# EAGLE schematic M8416P (EAGLE 6.6.0)

## Sheet 1 of 7
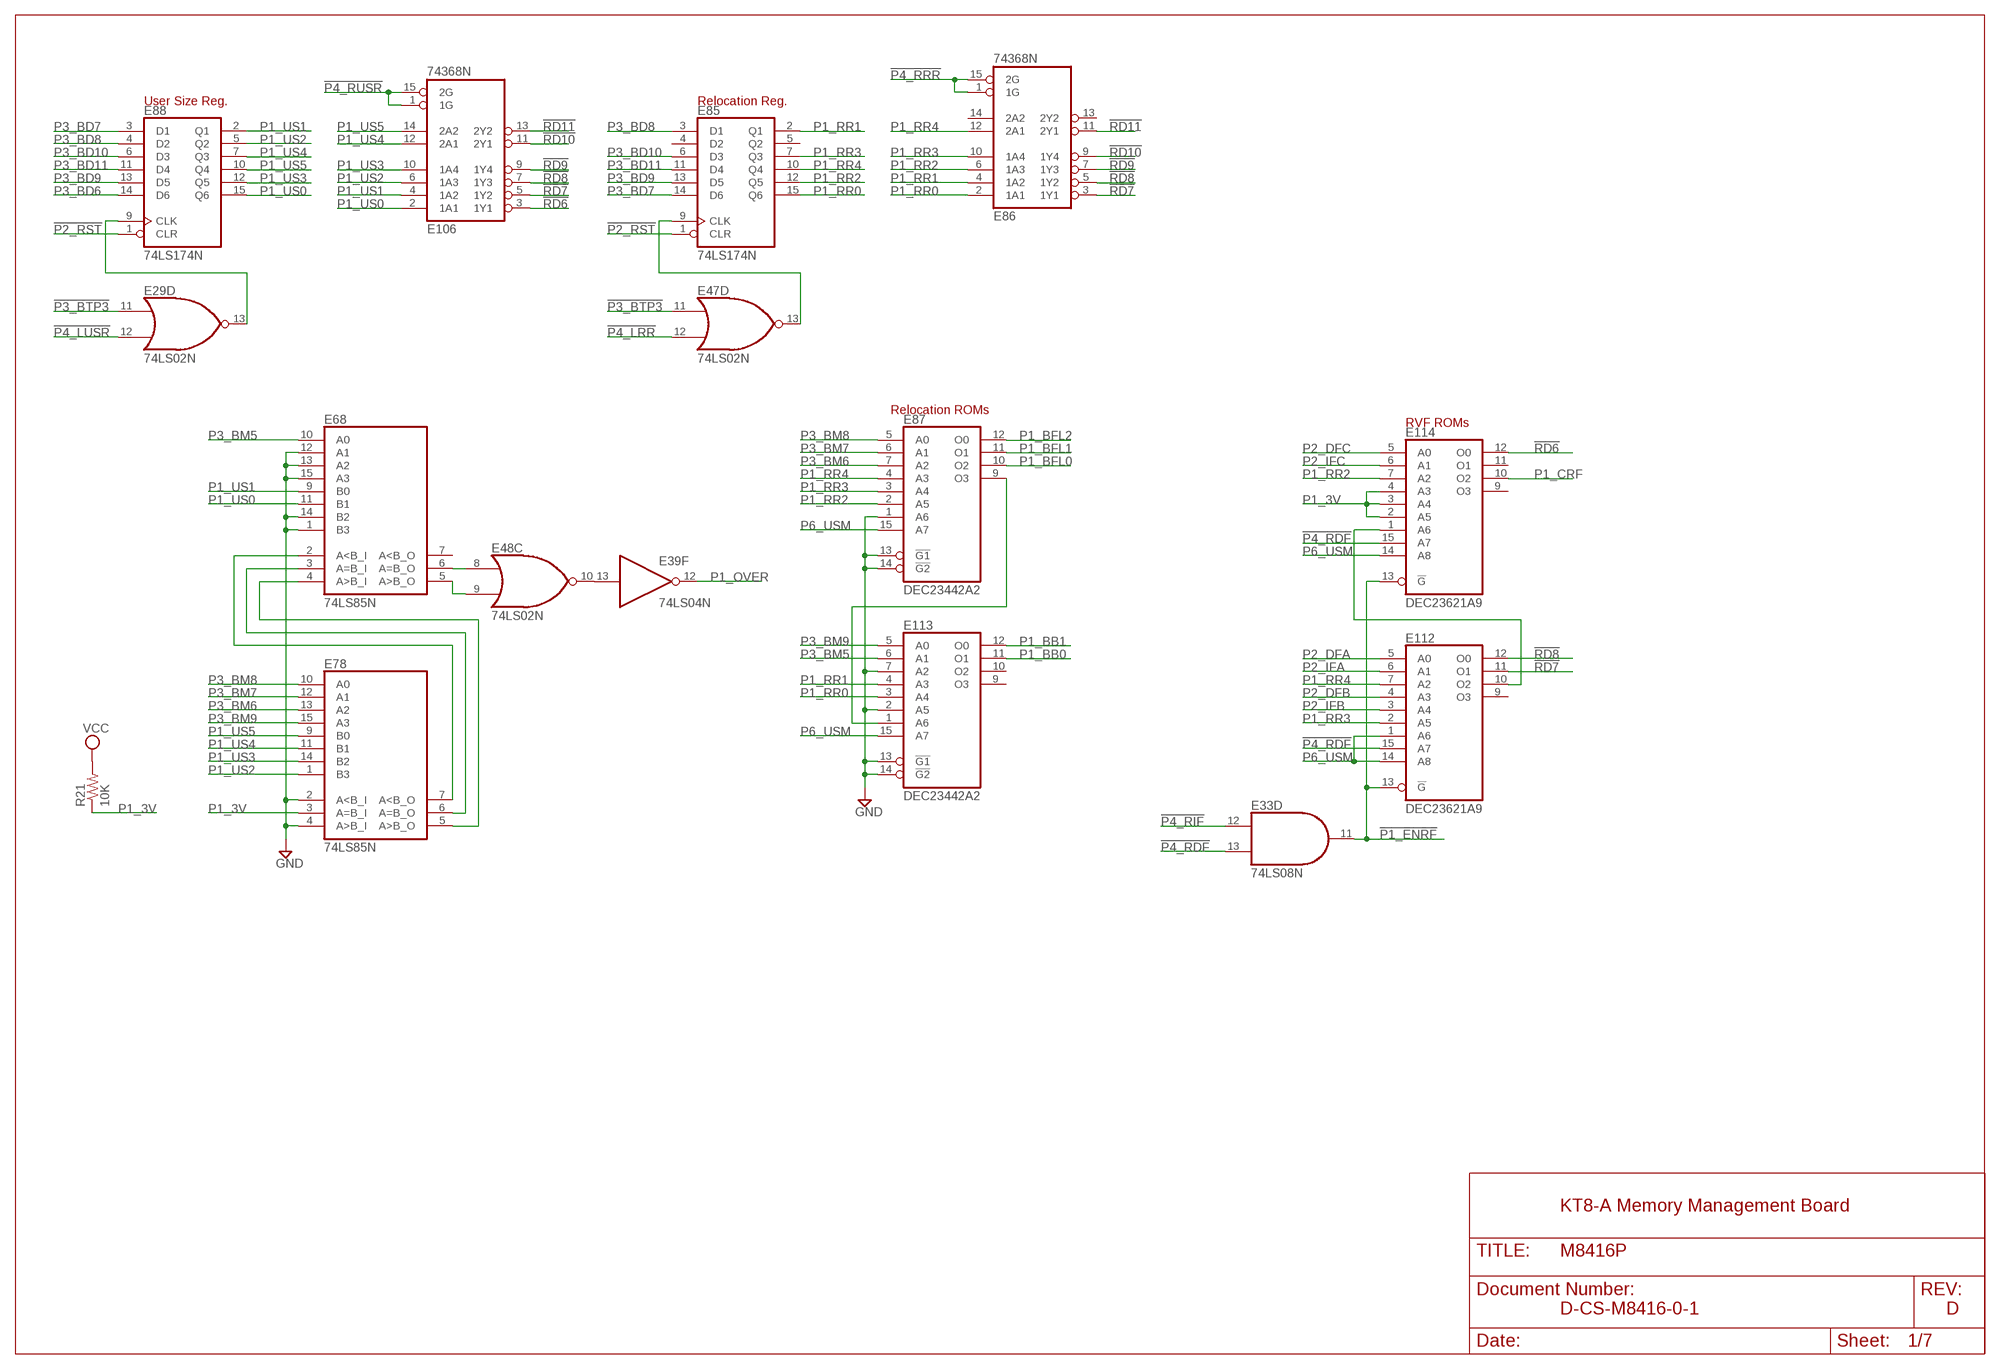
[diagram p0: schematic, sheet 1]

### Parts
E29  74LS02N  [DIL14]
E33  74LS08N  [DIL14]
E39  74LS04N  [DIL14]
E47  74LS02N  [DIL14]
E48  74LS02N  [DIL14]
E68  74LS85N  [DIL16]
E78  74LS85N  [DIL16]
E85  74LS174N  [DIL16]
E86  74368N  [DIL16]
E87  DEC23442A2  74S287  [DIL16]
E88  74LS174N  [DIL16]
E106  74368N  [DIL16]
E112  DEC23621A9  74S571  [DIL16]
E113  DEC23442A2  74S287  [DIL16]
E114  DEC23621A9  74S571  [DIL16]
R21  10K  R-US_0207/10  [0207/10]

### Nets
!P1_ENRF: E33.11(D:O) E112.13(!G) E114.13(!G) ; also sheet 5,6
!P2_RST: E85.1(CLR) E88.1(CLR) ; also sheet 2,6
!P3_BTP3: E29.11(D:I0) E47.11(D:I0) ; also sheet 3,6
!P4_LRR: E47.12(D:I1) ; also sheet 4
!P4_LUSR: E29.12(D:I1) ; also sheet 4
!P4_RDF: E33.13(D:I1) E112.15(A7) E114.15(A7) ; also sheet 4,5
!P4_RIF: E33.12(D:I0) ; also sheet 4
!P4_RRR: E86.1(1G) E86.15(2G) ; also sheet 4
!P4_RUSR: E106.1(1G) E106.15(2G) ; also sheet 4
!RD6: E106.3(1Y1) E114.12(O0) ; also sheet 2,3,5,6
!RD7: E86.3(1Y1) E106.5(1Y2) E112.11(O1) ; also sheet 2,3,5,6
!RD8: E86.5(1Y2) E106.7(1Y3) E112.12(O0) ; also sheet 2,3,5,6
!RD9: E86.7(1Y3) E106.9(1Y4) ; also sheet 2,3,5
!RD10: E86.9(1Y4) E106.11(2Y1) ; also sheet 2,3,5
!RD11: E86.11(2Y1) E106.13(2Y2) ; also sheet 2,3,5
GND: E68.1(B3) E68.12(A1) E68.13(A2) E68.14(B2) E68.15(A3) E78.2(A<B_I) E78.4(A>B_I) E87.1(A6) E87.13(!G1) E87.14(!G2) E113.2(A5) E113.7(A2) E113.13(!G1) E113.14(!G2) ; also sheet 2,3,4,5,6
N$1: E29.13(D:O) E88.9(CLK)
N$6: E112.10(O2) E114.1(A6)
N$8: E48.9(C:I1) E68.5(A>B_O)
N$9: E68.2(A<B_I) E78.7(A<B_O)
N$10: E68.3(A=B_I) E78.6(A=B_O)
N$11: E68.4(A>B_I) E78.5(A>B_O)
N$12: E48.8(C:I0) E68.6(A=B_O)
N$13: E39.13(F:I) E48.10(C:O)
N$15: E47.13(D:O) E85.9(CLK)
N$22: E87.9(O3) E113.1(A6)
P1_3V: E78.3(A=B_I) E114.2(A5) E114.3(A4) E114.4(A3) R21.1
P1_BB0: E113.11(O1) ; also sheet 5
P1_BB1: E113.12(O0) ; also sheet 5
P1_BFL0: E87.10(O2) ; also sheet 2
P1_BFL1: E87.11(O1) ; also sheet 2
P1_BFL2: E87.12(O0) ; also sheet 2
P1_CRF: E114.10(O2) ; also sheet 5
P1_OVER: E39.12(F:O) ; also sheet 4
P1_RR0: E85.15(Q6) E86.2(1A1) E113.3(A4) ; also sheet 5
P1_RR1: E85.2(Q1) E86.4(1A2) E113.4(A3) ; also sheet 5
P1_RR2: E85.12(Q5) E86.6(1A3) E87.2(A5) E114.7(A2)
P1_RR3: E85.7(Q3) E86.10(1A4) E87.3(A4) E112.2(A5)
P1_RR4: E85.10(Q4) E86.12(2A1) E87.4(A3) E112.7(A2)
P1_US0: E68.11(B1) E88.15(Q6) E106.2(1A1)
P1_US1: E68.9(B0) E88.2(Q1) E106.4(1A2)
P1_US2: E78.1(B3) E88.5(Q2) E106.6(1A3)
P1_US3: E78.14(B2) E88.12(Q5) E106.10(1A4)
P1_US4: E78.11(B1) E88.7(Q3) E106.12(2A1)
P1_US5: E78.9(B0) E88.10(Q4) E106.14(2A2)
P2_DFA: E112.5(A0) ; also sheet 2
P2_DFB: E112.4(A3) ; also sheet 2
P2_DFC: E114.5(A0) ; also sheet 2
P2_IFA: E112.6(A1) ; also sheet 2
P2_IFB: E112.3(A4) ; also sheet 2
P2_IFC: E114.6(A1) ; also sheet 2
P3_BD6: E88.14(D6) ; also sheet 2,3,5,6
P3_BD7: E85.14(D6) E88.3(D1) ; also sheet 2,3,5
P3_BD8: E85.3(D1) E88.4(D2) ; also sheet 2,3,5
P3_BD9: E85.13(D5) E88.13(D5) ; also sheet 2,3,5
P3_BD10: E85.6(D3) E88.6(D3) ; also sheet 2,3,5
P3_BD11: E85.11(D4) E88.11(D4) ; also sheet 2,3,5
P3_BM5: E68.10(A0) E113.6(A1) ; also sheet 3,4
P3_BM6: E78.13(A2) E87.7(A2) ; also sheet 3,4
P3_BM7: E78.12(A1) E87.6(A1) ; also sheet 3,4
P3_BM8: E78.10(A0) E87.5(A0) ; also sheet 3,4
P3_BM9: E78.15(A3) E113.5(A0) ; also sheet 3,4
P6_USM: E87.15(A7) E112.1(A6) E112.14(A8) E113.15(A7) E114.14(A8) ; also sheet 3,4,5,6
VCC: R21.2 ; also sheet 2,3,4,5,6
Unconnected: E68.7(A<B_O) E85.4(D2) E85.5(Q2) E86.13(2Y2) E86.14(2A2) E112.9(O3) E113.9(O3) E113.10(O2) E114.9(O3) E114.11(O1)

### Notes on the sheet
- User Size Reg. | Relocation Reg.
- Relocation ROMs
- RVF ROMs
- KT8-A Memory Management Board
- D-CS-M8416-0-1 | D

## Sheet 2 of 7
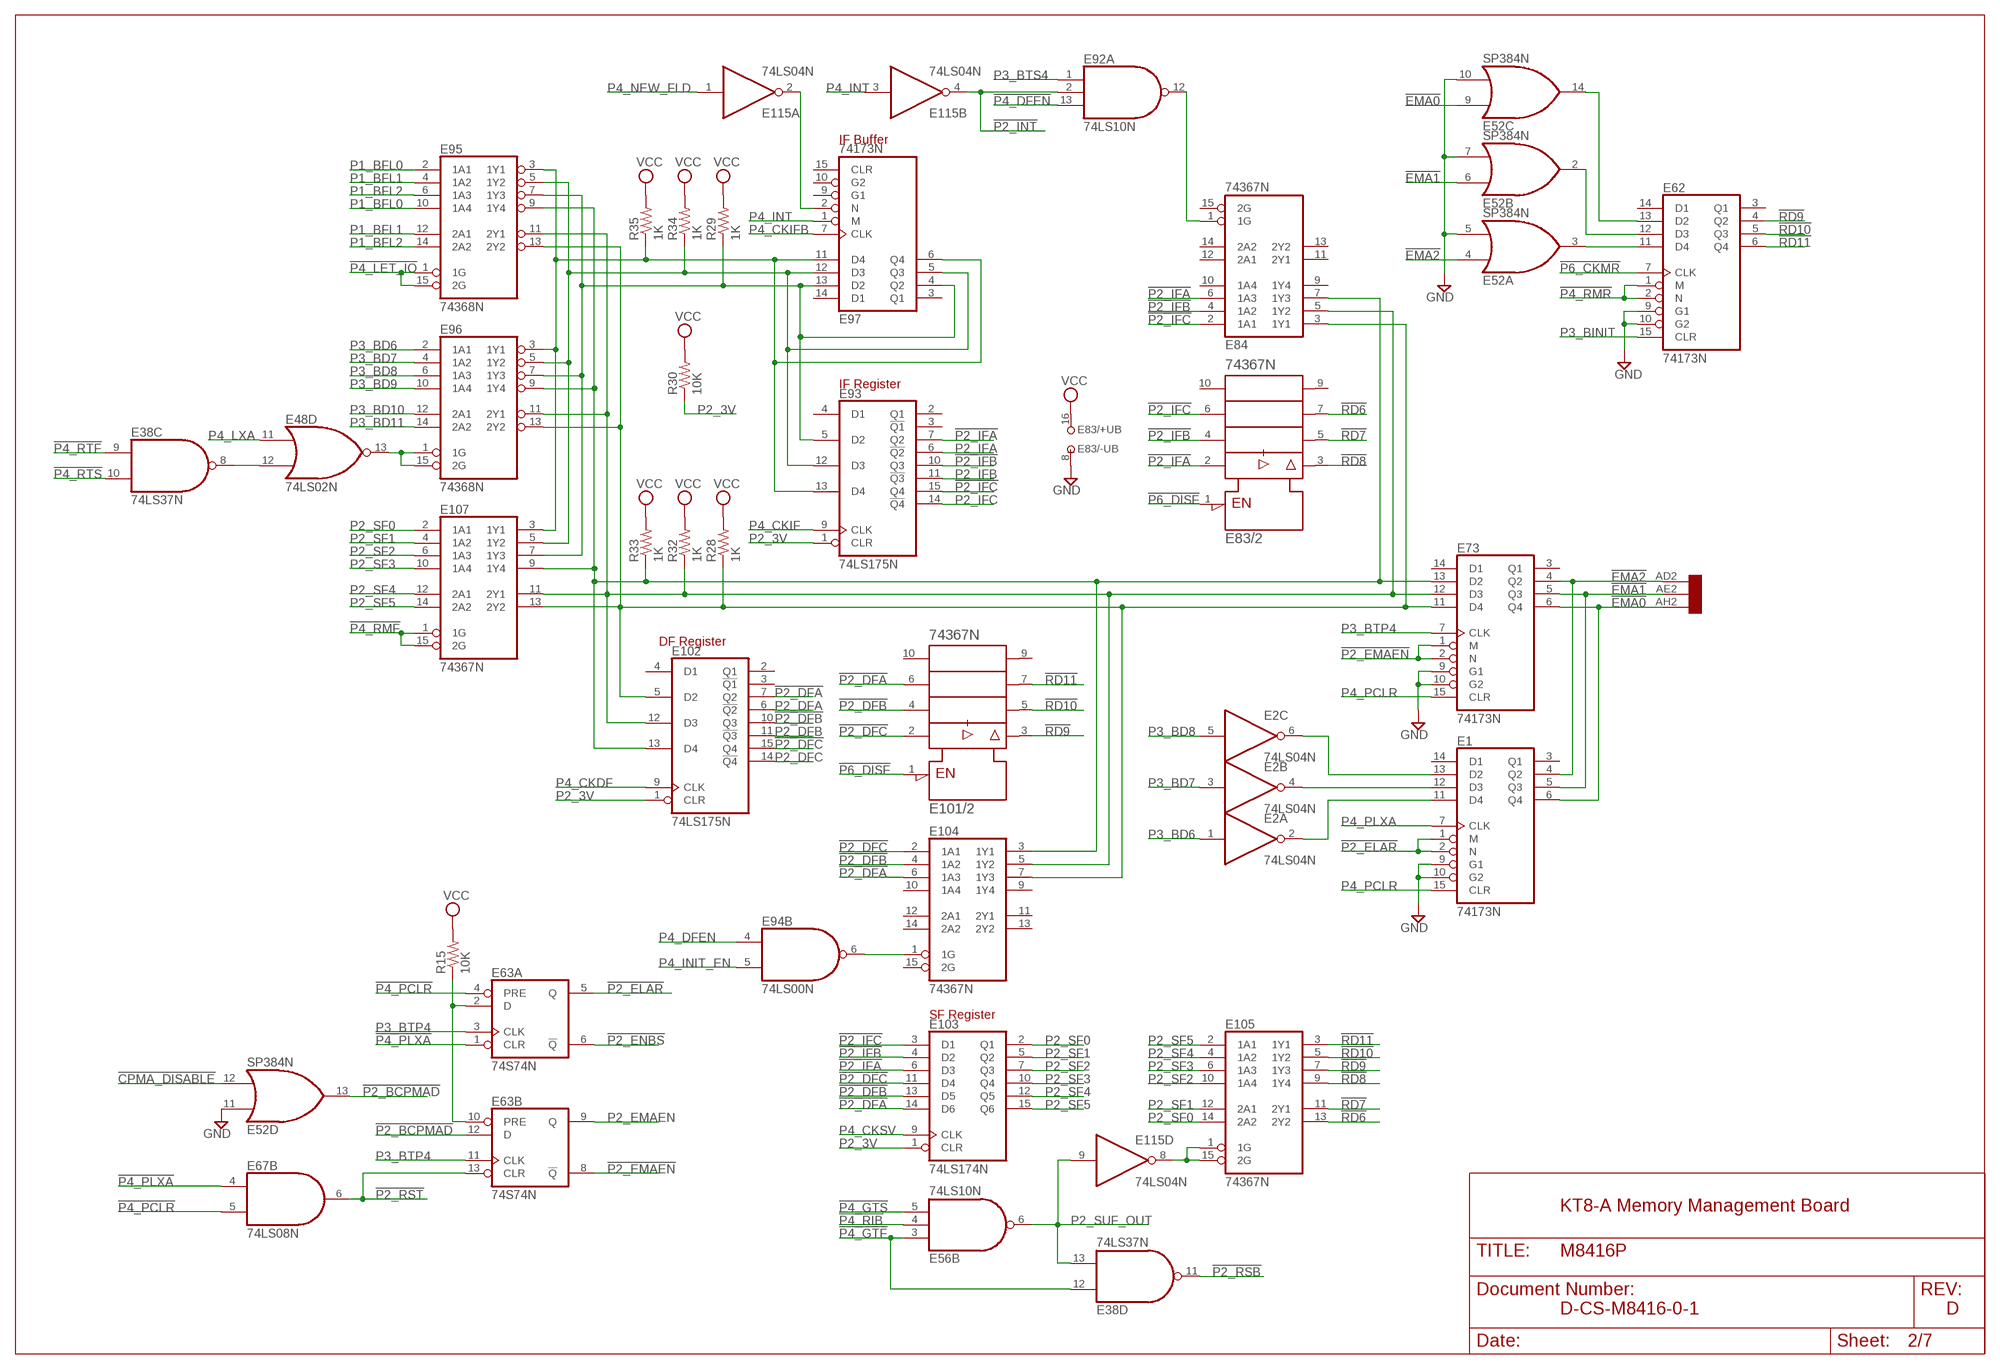
[diagram p1: schematic, sheet 2]

### Parts
E1  74173N  74LS173N  [DIL16]
E2  74LS04N  [DIL14]
E38  74LS37N  [DIL14]
E52  SP384N  [DIL14]
E56  74LS10N  [DIL14]
E62  74173N  74LS173N  [DIL16]
E63  74S74N  [DIL14]
E67  74LS08N  [DIL14]
E73  74173N  74LS173N  [DIL16]
E83  74367N  [DIL16]
E84  74367N  [DIL16]
E92  74LS10N  [DIL14]
E93  74LS175N  [DIL16]
E94  74LS00N  [DIL14]
E95  74368N  [DIL16]
E96  74368N  [DIL16]
E97  74173N  74LS173N  [DIL16]
E101  74367N  [DIL16]
E102  74LS175N  [DIL16]
E103  74LS174N  [DIL16]
E104  74367N  [DIL16]
E105  74367N  [DIL16]
E107  74367N  [DIL16]
E115  74LS04N  [DIL14]
R15  10K  R-US_0207/10  [0207/10]
R28  1K  R-US_0207/10  [0207/10]
R29  1K  R-US_0207/10  [0207/10]
R30  10K  R-US_0207/10  [0207/10]
R32  1K  R-US_0207/10  [0207/10]
R33  1K  R-US_0207/10  [0207/10]
R34  1K  R-US_0207/10  [0207/10]
R35  1K  R-US_0207/10  [0207/10]
U$1  HEX  [EDGE-CON12]

### Nets
!CPMA_DISABLE: E52.12(D:I1) ; also sheet 3
!EMA0: E1.6(Q4) E52.9(C:I0) E73.6(Q4) U$1.AH2
!EMA1: E1.5(Q3) E52.6(B:I0) E73.5(Q3) U$1.AE2
!EMA2: E1.4(Q2) E52.4(A:I0) E73.4(Q2) U$1.AD2
!P2_BCPMAD: E52.13(D:O) E63.12(B:D) ; also sheet 5
!P2_DFA: E101.6(/2:A3) E102.7(Q2) E103.14(D6) E104.6(1A3)
!P2_DFB: E101.4(/2:A2) E102.10(Q3) E103.13(D5) E104.4(1A2)
!P2_DFC: E101.2(/2:A1) E102.15(Q4) E103.11(D4) E104.2(1A1)
!P2_ELAR: E1.1(M) E1.2(N) E63.5(A:Q) ; also sheet 6
!P2_EMAEN: E63.8(B:!Q) E73.1(M) E73.2(N)
!P2_ENBS: E63.6(A:!Q) ; also sheet 6
!P2_IFA: E83.2(/2:A1) E84.6(1A3) E93.7(Q2) E103.6(D3)
!P2_IFB: E83.4(/2:A2) E84.4(1A2) E93.10(Q3) E103.4(D2)
!P2_IFC: E83.6(/2:A3) E84.2(1A1) E93.15(Q4) E103.3(D1)
!P2_INT: E92.2(A:I1) E115.4(B:O)
!P2_RSB: E38.11(D:O) ; also sheet 5
!P2_RST: E63.13(B:CLR) E67.6(B:O) ; also sheet 1,6
!P4_DFEN: E92.13(A:I2) ; also sheet 4
!P4_GTF: E38.12(D:I0) E56.3(B:I0) ; also sheet 4,6
!P4_GTS: E56.5(B:I2) ; also sheet 4,6
!P4_LET_IO: E95.1(1G) E95.15(2G) ; also sheet 4
!P4_PCLR: E63.4(A:PRE) E67.5(B:I1) ; also sheet 4,6
!P4_PLXA: E63.1(A:CLR) E67.4(B:I0) ; also sheet 4
!P4_RIB: E56.4(B:I1) ; also sheet 4
!P4_RMF: E107.1(1G) E107.15(2G) ; also sheet 4,5,6
!P4_RMR: E62.1(M) E62.2(N) ; also sheet 4,6
!P4_RTF: E38.9(C:I0) ; also sheet 4
!P4_RTS: E38.10(C:I1) ; also sheet 4,5
!P6_CKMR: E62.7(CLK) ; also sheet 6
!P6_DISF: E83.1(/2:!G) E101.1(/2:!G) ; also sheet 6
!RD6: E83.7(/2:Y3) E105.13(2Y2) ; also sheet 1,3,5,6
!RD7: E83.5(/2:Y2) E105.11(2Y1) ; also sheet 1,3,5,6
!RD8: E83.3(/2:Y1) E105.9(1Y4) ; also sheet 1,3,5,6
!RD9: E62.4(Q2) E101.3(/2:Y1) E105.7(1Y3) ; also sheet 1,3,5
!RD10: E62.5(Q3) E101.5(/2:Y2) E105.5(1Y2) ; also sheet 1,3,5
!RD11: E62.6(Q4) E101.7(/2:Y3) E105.3(1Y1) ; also sheet 1,3,5
GND: E1.9(G1) E1.10(G2) E52.5(A:I1) E52.7(B:I1) E52.10(C:I1) E52.11(D:I0) E62.9(G1) E62.10(G2) E73.9(G1) E73.10(G2) E83.8(/-UB:-UB) ; also sheet 1,3,4,5,6
N$2: E48.13(D:O) E96.1(1G) E96.15(2G)
N$3: E38.8(C:O) E48.12(D:I1)
N$18: E93.13(D4) E95.3(1Y1) E96.3(1Y1) E97.6(Q4) E97.11(D4) E107.3(1Y1) R35.1
N$19: E93.12(D3) E95.5(1Y2) E96.5(1Y2) E97.5(Q3) E97.12(D3) E107.5(1Y2) R34.1
N$20: E93.5(D2) E95.7(1Y3) E96.7(1Y3) E97.4(Q2) E97.13(D2) E107.7(1Y3) R29.1
N$38: E73.13(D2) E84.7(1Y3) E95.9(1Y4) E96.9(1Y4) E102.13(D4) E104.3(1Y1) E107.9(1Y4) R33.1
N$39: E73.12(D3) E84.5(1Y2) E95.11(2Y1) E96.11(2Y1) E102.12(D3) E104.5(1Y2) E107.11(2Y1) R32.1
N$40: E73.11(D4) E84.3(1Y1) E95.13(2Y2) E96.13(2Y2) E102.5(D2) E104.7(1Y3) E107.13(2Y2) R28.1
N$41: E97.2(N) E115.2(A:O)
N$42: E84.1(1G) E92.12(A:O)
N$43: E1.11(D4) E2.2(A:O)
N$44: E1.12(D3) E2.4(B:O)
N$45: E1.13(D2) E2.6(C:O)
N$46: E52.3(A:O) E62.11(D4)
N$47: E52.2(B:O) E62.12(D3)
N$48: E52.14(C:O) E62.13(D2)
N$49: E94.6(B:O) E104.1(1G)
N$50: E63.2(A:D) E63.10(B:PRE) R15.1
N$56: E105.1(1G) E105.15(2G) E115.8(D:O)
P1_BFL0: E95.2(1A1) E95.10(1A4) ; also sheet 1
P1_BFL1: E95.4(1A2) E95.12(2A1) ; also sheet 1
P1_BFL2: E95.6(1A3) E95.14(2A2) ; also sheet 1
P2_3V: E93.1(CLR) E102.1(CLR) E103.1(CLR) R30.1
P2_DFA: E102.6(!Q2) ; also sheet 1
P2_DFB: E102.11(!Q3) ; also sheet 1
P2_DFC: E102.14(!Q4) ; also sheet 1
P2_EMAEN: E63.9(B:Q) ; also sheet 6
P2_IFA: E93.6(!Q2) ; also sheet 1
P2_IFB: E93.11(!Q3) ; also sheet 1
P2_IFC: E93.14(!Q4) ; also sheet 1
P2_SF0: E103.2(Q1) E105.14(2A2) E107.2(1A1)
P2_SF1: E103.5(Q2) E105.12(2A1) E107.4(1A2)
P2_SF2: E103.7(Q3) E105.10(1A4) E107.6(1A3)
P2_SF3: E103.10(Q4) E105.6(1A3) E107.10(1A4)
P2_SF4: E103.12(Q5) E105.4(1A2) E107.12(2A1)
P2_SF5: E103.15(Q6) E105.2(1A1) E107.14(2A2)
P2_SUF_OUT: E38.13(D:I1) E56.6(B:O) E115.9(D:I) ; also sheet 6
P3_BD6: E2.1(A:I) E96.2(1A1) ; also sheet 1,3,5,6
P3_BD7: E2.3(B:I) E96.4(1A2) ; also sheet 1,3,5
P3_BD8: E2.5(C:I) E96.6(1A3) ; also sheet 1,3,5
P3_BD9: E96.10(1A4) ; also sheet 1,3,5
P3_BD10: E96.12(2A1) ; also sheet 1,3,5
P3_BD11: E96.14(2A2) ; also sheet 1,3,5
P3_BINIT: E62.15(CLR) ; also sheet 3,5,6
P3_BTP4: E63.3(A:CLK) E63.11(B:CLK) E73.7(CLK) ; also sheet 3,4,5,6
P3_BTS4: E92.1(A:I0) ; also sheet 3,5
P4_CKDF: E102.9(CLK) ; also sheet 4
P4_CKIF: E93.9(CLK) ; also sheet 4,5
P4_CKIFB: E97.7(CLK) ; also sheet 4
P4_CKSV: E103.9(CLK) ; also sheet 4,5,6
P4_DFEN: E94.4(B:I0) ; also sheet 4,5
P4_INIT_EN: E94.5(B:I1) ; also sheet 4
P4_INT: E97.1(M) E115.3(B:I) ; also sheet 4
P4_LXA: E48.11(D:I0) ; also sheet 3,4,5
P4_NEW_FLD: E115.1(A:I) ; also sheet 4,5,6
P4_PCLR: E1.15(CLR) E73.15(CLR) ; also sheet 4,6
P4_PLXA: E1.7(CLK) ; also sheet 4,6
VCC: E83.16(/+UB:+UB) R15.2 R28.2 R29.2 R30.2 R32.2 R33.2 R34.2 R35.2 ; also sheet 1,3,4,5,6
Unconnected: E1.3(Q1) E1.14(D1) E62.3(Q1) E62.14(D1) E73.3(Q1) E73.14(D1) E83.9(/2:Y4) E83.10(/2:A4) E84.9(1Y4) E84.10(1A4) E84.11(2Y1) E84.12(2A1) E84.13(2Y2) E84.14(2A2) E84.15(2G) E93.2(Q1) E93.3(!Q1) E93.4(D1) E97.3(Q1) E97.9(G1) E97.10(G2) E97.14(D1) E97.15(CLR) E101.9(/2:Y4) E101.10(/2:A4) E102.2(Q1) E102.3(!Q1) E102.4(D1) E104.9(1Y4) E104.10(1A4) E104.11(2Y1) E104.12(2A1) E104.13(2Y2) E104.14(2A2) E104.15(2G) U$1.AA1 U$1.AB1 U$1.AB2 U$1.AD1 U$1.AE1 U$1.AH1 U$1.AJ1 U$1.AJ2 U$1.AK2 U$1.AL2 U$1.AM2 U$1.AP2 U$1.AR2 U$1.AS2 U$1.AU2 U$1.BA1 U$1.BB1 U$1.BB2 U$1.BD1 U$1.BD2 U$1.BE1 U$1.BH1 U$1.BJ1 U$1.BJ2 U$1.BK2 U$1.BL2 U$1.BR2 U$1.BS2 U$1.CA1 U$1.CB1 U$1.CB2 U$1.CJ1 U$1.CK1 U$1.CL2 U$1.CM1 U$1.CR2 U$1.CS2 U$1.DA1 U$1.DB1 U$1.DB2 U$1.DD1 U$1.DE1 U$1.DH1 U$1.DH2 U$1.DJ1 U$1.DL2 U$1.DS2 U$1.DV2 U$1.EA1 U$1.EA2 U$1.EB1 U$1.EC1 U$1.EC2 U$1.ED1 U$1.EE1 U$1.EE2 U$1.EF1 U$1.EF2 U$1.EH1 U$1.EH2 U$1.EJ1 U$1.EJ2 U$1.EK1 U$1.EK2 U$1.EL1 U$1.EM1 U$1.EM2 U$1.EN1 U$1.EN2 U$1.EP1 U$1.ER1 U$1.ER2 U$1.ES1 U$1.ES2 U$1.ET1 U$1.ET2 U$1.EU1 U$1.EU2 U$1.EV1 U$1.EV2 U$1.FA1 U$1.FA2 U$1.FB1 U$1.FB2 U$1.FC1 U$1.FC2 U$1.FD1 U$1.FD2 U$1.FE1 U$1.FE2 U$1.FF1 U$1.FF2 U$1.FH1 U$1.FH2 U$1.FJ1 U$1.FJ2 U$1.FK1 U$1.FK2 U$1.FL1 U$1.FL2 U$1.FM1 U$1.FM2 U$1.FN1 U$1.FN2 U$1.FP1 U$1.FP2 U$1.FR1 U$1.FR2 U$1.FS1 U$1.FS2 U$1.FT1 U$1.FT2 U$1.FU1 U$1.FU2 U$1.FV1 U$1.FV2

### Notes on the sheet
- IF Buffer
- IF Register
- DF Register
- SF Register
- KT8-A Memory Management Board
- D-CS-M8416-0-1 | D

## Sheet 3 of 7
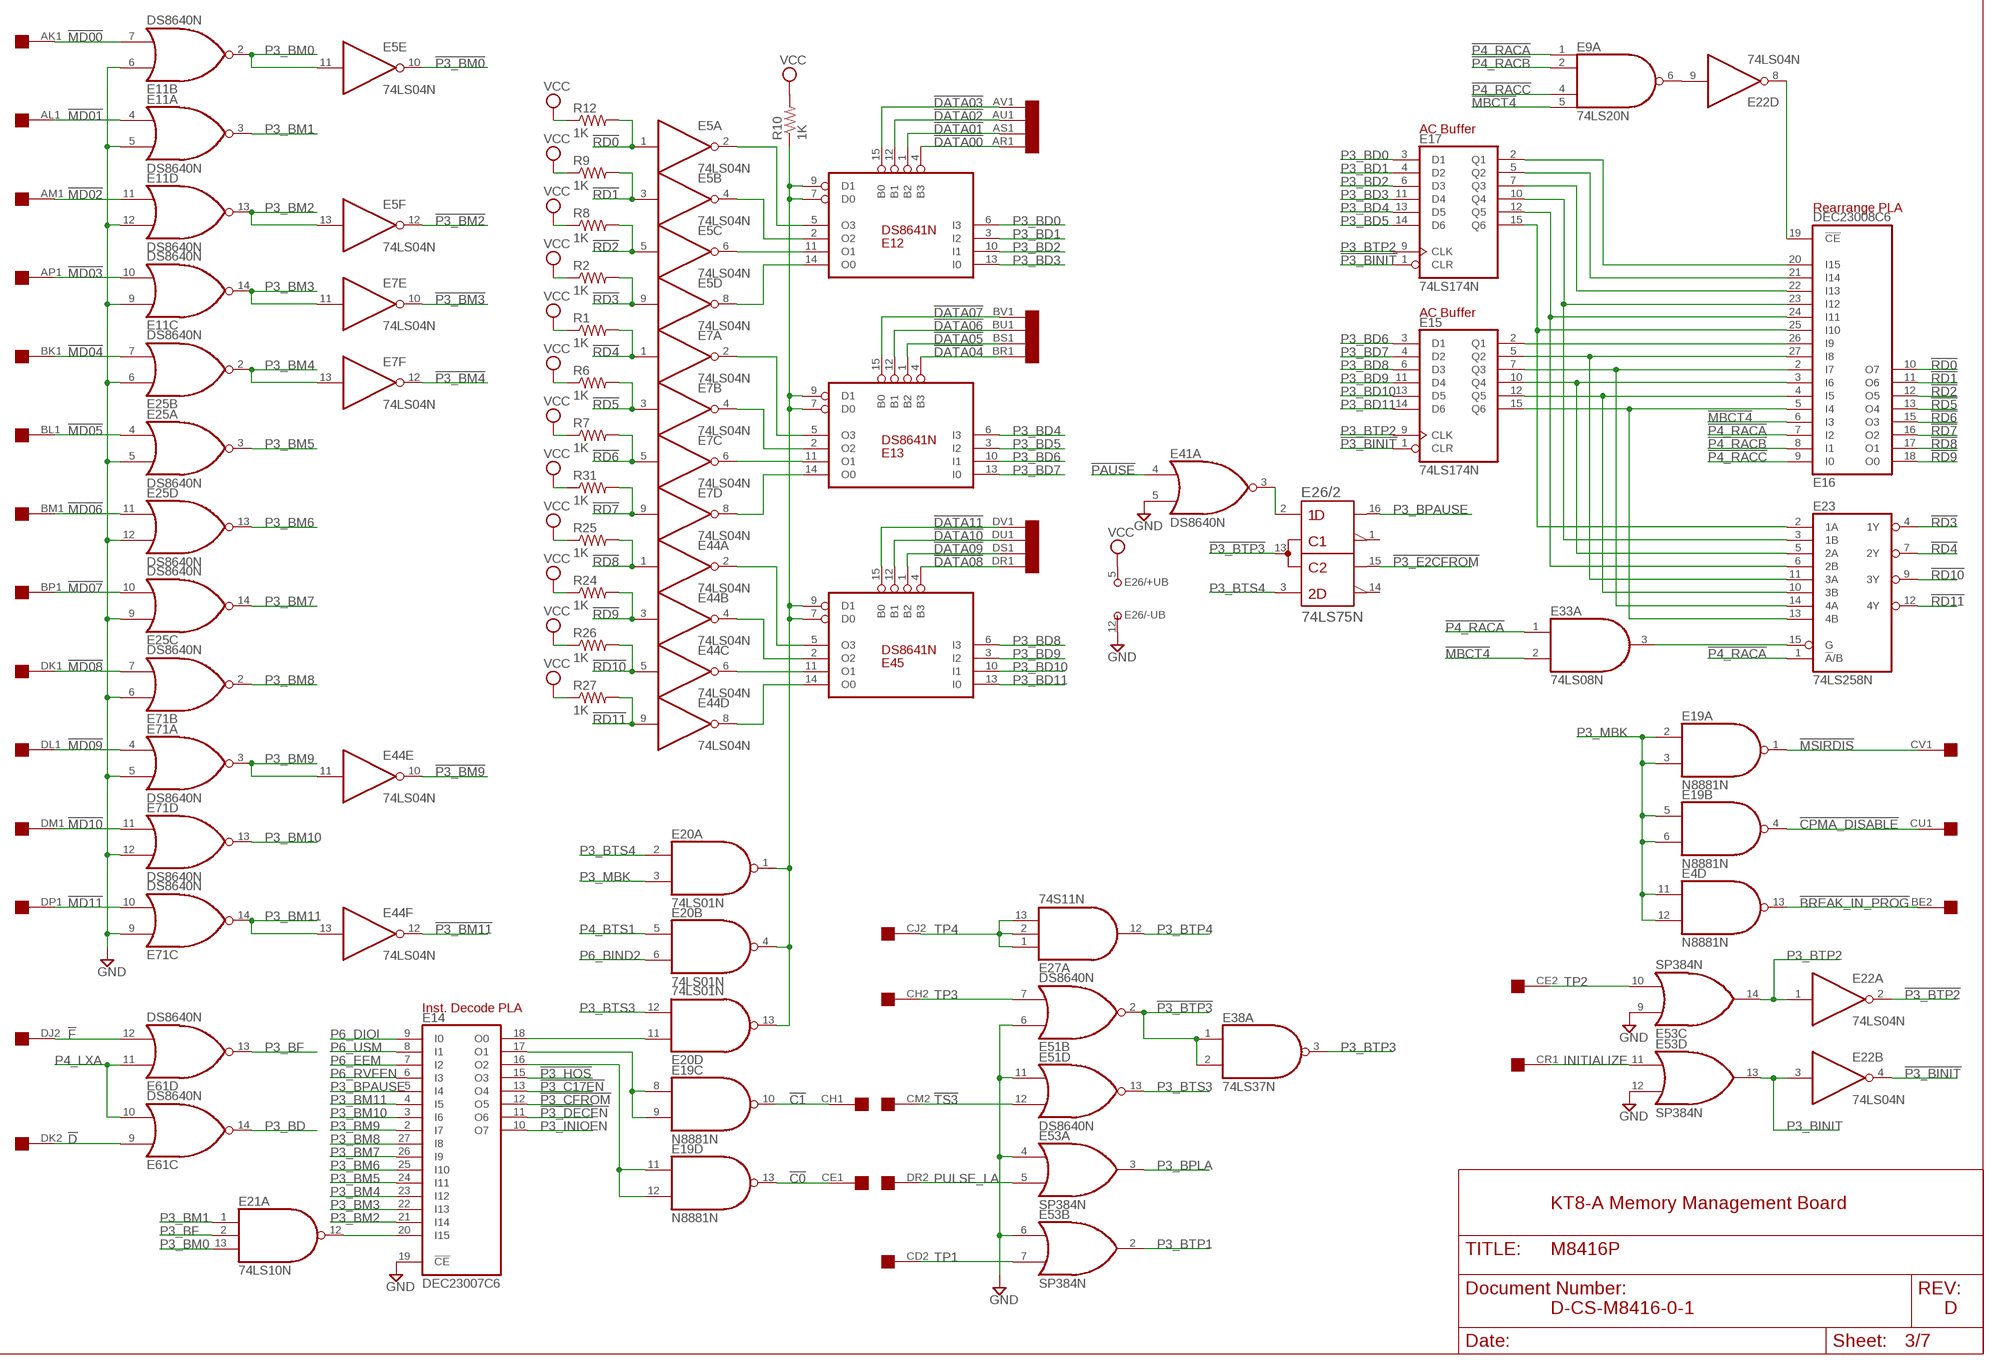
[diagram p2: schematic, sheet 3, part 1 of 2]
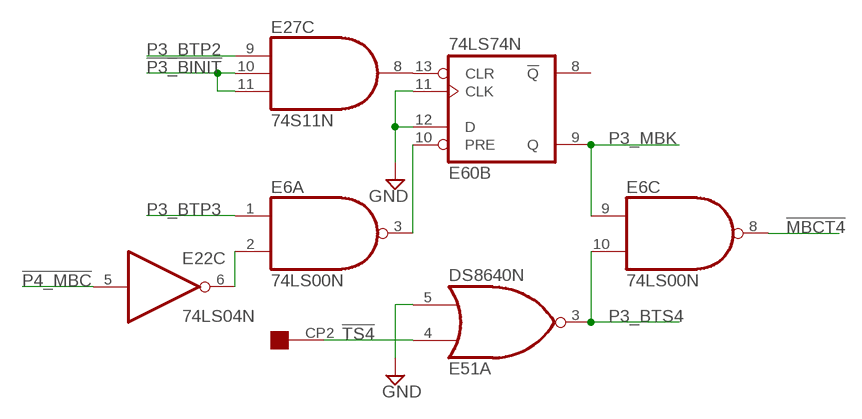
[diagram p3: schematic, sheet 3, part 2 of 2]

### Parts
E4  N8881N  [DIL14]
E5  74LS04N  [DIL14]
E6  74LS00N  [DIL14]
E7  74LS04N  [DIL14]
E9  74LS20N  [DIL14]
E11  DS8640N  [DIL14]
E12  DS8641N  [DIL16]
E13  DS8641N  [DIL16]
E14  DEC23007C6  82S100  [DIL28]
E15  74LS174N  [DIL16]
E16  DEC23008C6  82S100  [DIL28]
E17  74LS174N  [DIL16]
E19  N8881N  [DIL14]
E20  74LS01N  [DIL14]
E21  74LS10N  [DIL14]
E22  74LS04N  [DIL14]
E23  74LS258N  [DIL16]
E25  DS8640N  [DIL14]
E26  74LS75N  7475N  [DIL16]
E27  74S11N  [DIL14]
E41  DS8640N  [DIL14]
E44  74LS04N  [DIL14]
E45  DS8641N  [DIL16]
E51  DS8640N  [DIL14]
E53  SP384N  [DIL14]
E60  74LS74N  [DIL14]
E61  DS8640N  [DIL14]
E71  DS8640N  [DIL14]
R1  1K  R-US_0207/10  [0207/10]
R2  1K  R-US_0207/10  [0207/10]
R6  1K  R-US_0207/10  [0207/10]
R7  1K  R-US_0207/10  [0207/10]
R8  1K  R-US_0207/10  [0207/10]
R9  1K  R-US_0207/10  [0207/10]
R10  1K  R-US_0207/10  [0207/10]
R12  1K  R-US_0207/10  [0207/10]
R24  1K  R-US_0207/10  [0207/10]
R25  1K  R-US_0207/10  [0207/10]
R26  1K  R-US_0207/10  [0207/10]
R27  1K  R-US_0207/10  [0207/10]
R31  1K  R-US_0207/10  [0207/10]

### Nets
!BREAK_IN_PROG: E4.13(D:O) U$1.BE2
!C0: E19.13(D:O) U$1.CE1
!C1: E19.10(C:O) U$1.CH1
!CPMA_DISABLE: E19.4(B:O) U$1.CU1 ; also sheet 2
!D: E61.9(C:I0) U$1.DK2
!DATA00: E12.4(B3) U$1.AR1
!DATA01: E12.1(B2) U$1.AS1
!DATA02: E12.12(B1) U$1.AU1
!DATA03: E12.15(B0) U$1.AV1
!DATA04: E13.4(B3) U$1.BR1
!DATA05: E13.1(B2) U$1.BS1
!DATA06: E13.12(B1) U$1.BU1
!DATA07: E13.15(B0) U$1.BV1
!DATA08: E45.4(B3) U$1.DR1
!DATA09: E45.1(B2) U$1.DS1
!DATA10: E45.12(B1) U$1.DU1
!DATA11: E45.15(B0) U$1.DV1
!F: E61.12(D:I1) U$1.DJ2
!MBCT4: E6.8(C:O) E9.5(A:I3) E16.6(I3) E33.2(A:I1)
!MD00: E11.7(B:I1) U$1.AK1
!MD01: E11.4(A:I0) U$1.AL1
!MD02: E11.11(D:I0) U$1.AM1
!MD03: E11.10(C:I1) U$1.AP1
!MD04: E25.7(B:I1) U$1.BK1
!MD05: E25.4(A:I0) U$1.BL1
!MD06: E25.11(D:I0) U$1.BM1
!MD07: E25.10(C:I1) U$1.BP1
!MD08: E71.7(B:I1) U$1.DK1
!MD09: E71.4(A:I0) U$1.DL1
!MD10: E71.11(D:I0) U$1.DM1
!MD11: E71.10(C:I1) U$1.DP1
!MSIRDIS: E19.1(A:O) U$1.CV1
!P3_BINIT: E15.1(CLR) E17.1(CLR) E22.4(B:O) E27.10(C:I1) E27.11(C:I2) ; also sheet 4
!P3_BM0: E5.10(E:O) ; also sheet 4
!P3_BM2: E5.12(F:O) ; also sheet 4
!P3_BM3: E7.10(E:O) ; also sheet 4
!P3_BM4: E7.12(F:O) ; also sheet 4
!P3_BM9: E44.10(E:O) ; also sheet 4
!P3_BM11: E44.12(F:O) ; also sheet 4
!P3_BTP2: E22.2(A:O) ; also sheet 6
!P3_BTP3: E26.13(/2:1C,2C) E38.1(A:I0) E38.2(A:I1) E51.2(B:O) ; also sheet 1,6
!P3_C17EN: E14.13(O4) ; also sheet 4
!P3_CFROM: E14.12(O5) ; also sheet 4
!P3_DECEN: E14.11(O6) ; also sheet 4
!P3_E2CFROM: E26.15(/2:2Q) ; also sheet 4
!P3_HOS: E14.15(O3) ; also sheet 4
!P4_MBC: E22.5(C:I) ; also sheet 4
!P4_RACA: E9.1(A:I0) E16.7(I2) E23.1(!A!/B) E33.1(A:I0) ; also sheet 4
!P4_RACB: E9.2(A:I1) E16.8(I1) ; also sheet 4
!P4_RACC: E9.4(A:I2) E16.9(I0) ; also sheet 4
!PAUSE: E41.4(A:I0) ; also sheet 4
!RD0: E5.1(A:I) E16.10(O7) R12.2 ; also sheet 6
!RD1: E5.3(B:I) E16.11(O6) R9.2 ; also sheet 5,6
!RD2: E5.5(C:I) E16.12(O5) R8.2 ; also sheet 5,6
!RD3: E5.9(D:I) E23.4(1Y) R2.2 ; also sheet 4,5,6
!RD4: E7.1(A:I) E23.7(2Y) R1.2 ; also sheet 5,6
!RD5: E7.3(B:I) E16.13(O4) R6.2 ; also sheet 5,6
!RD6: E7.5(C:I) E16.15(O3) R7.2 ; also sheet 1,2,5,6
!RD7: E7.9(D:I) E16.16(O2) R31.2 ; also sheet 1,2,5,6
!RD8: E16.17(O1) E44.1(A:I) R25.2 ; also sheet 1,2,5,6
!RD9: E16.18(O0) E44.3(B:I) R24.2 ; also sheet 1,2,5
!RD10: E23.9(3Y) E44.5(C:I) R26.2 ; also sheet 1,2,5
!RD11: E23.12(4Y) E44.9(D:I) R27.2 ; also sheet 1,2,5
!TS3: E51.12(D:I1) U$1.CM2
!TS4: E51.4(A:I0) U$1.CP2
GND: E11.5(A:I1) E11.6(B:I0) E11.9(C:I0) E11.12(D:I1) E14.19(!CE) E25.5(A:I1) E25.6(B:I0) E25.9(C:I0) E25.12(D:I1) E26.12(/-UB:-UB) E41.5(A:I1) E51.5(A:I1) E51.6(B:I0) E51.11(D:I0) E53.4(A:I0) E53.6(B:I0) E53.9(C:I0) E53.12(D:I1) E60.11(B:CLK) E60.12(B:D) E71.5(A:I1) E71.6(B:I0) E71.9(C:I0) E71.12(D:I1) ; also sheet 1,2,4,5,6
INITIALIZE: E53.11(D:I0) U$1.CR1
N$5: E27.8(C:O) E60.13(B:CLR)
N$51: E16.20(I15) E17.2(Q1)
N$52: E16.21(I14) E17.5(Q2)
N$53: E16.22(I13) E17.7(Q3)
N$54: E16.23(I12) E17.10(Q4) E23.3(1B)
N$55: E16.24(I11) E17.12(Q5) E23.6(2B)
N$57: E16.25(I10) E17.15(Q6) E23.2(1A)
N$58: E15.2(Q1) E16.26(I9)
N$59: E15.5(Q2) E16.27(I8) E23.11(3A)
N$60: E15.7(Q3) E16.2(I7) E23.14(4A)
N$61: E15.10(Q4) E16.3(I6) E23.5(2A)
N$62: E15.12(Q5) E16.4(I5) E23.10(3B)
N$63: E15.15(Q6) E16.5(I4) E23.13(4B)
N$64: E16.19(!CE) E22.8(D:O)
N$65: E9.6(A:O) E22.9(D:I)
N$66: E23.15(G) E33.3(A:O)
N$68: E6.3(A:O) E60.10(B:PRE)
N$69: E14.20(I15) E21.12(A:O)
N$70: E44.8(D:O) E45.14(O0)
N$71: E44.2(A:O) E45.5(O3)
N$72: E14.18(O0) E20.11(D:I0)
N$73: E14.17(O1) E19.8(C:I0) E19.9(C:I1)
N$74: E14.16(O2) E19.11(D:I0) E19.12(D:I1)
N$75: E44.4(B:O) E45.2(O2)
N$76: E44.6(C:O) E45.11(O1)
N$77: E12.7(D0) E12.9(D1) E13.7(D0) E13.9(D1) E20.1(A:O) E20.4(B:O) E20.13(D:O) E45.7(D0) E45.9(D1) R10.1
N$78: E7.6(C:O) E13.11(O1)
N$79: E7.8(D:O) E13.14(O0)
N$80: E7.4(B:O) E13.2(O2)
N$81: E7.2(A:O) E13.5(O3)
N$82: E5.8(D:O) E12.14(O0)
N$83: E5.6(C:O) E12.11(O1)
N$84: E5.4(B:O) E12.2(O2)
N$85: E5.2(A:O) E12.5(O3)
N$86: E6.2(A:I1) E22.6(C:O)
N$88: E26.2(/2:1D) E41.3(A:O)
P3_BD: E61.14(C:O) ; also sheet 4
P3_BD0: E12.6(I3) E17.3(D1) ; also sheet 5,6
P3_BD1: E12.3(I2) E17.4(D2) ; also sheet 5,6
P3_BD2: E12.10(I1) E17.6(D3) ; also sheet 5,6
P3_BD3: E12.13(I0) E17.11(D4) ; also sheet 5,6
P3_BD4: E13.6(I3) E17.13(D5) ; also sheet 5,6
P3_BD5: E13.3(I2) E17.14(D6) ; also sheet 5,6
P3_BD6: E13.10(I1) E15.3(D1) ; also sheet 1,2,5,6
P3_BD7: E13.13(I0) E15.4(D2) ; also sheet 1,2,5
P3_BD8: E15.6(D3) E45.6(I3) ; also sheet 1,2,5
P3_BD9: E15.11(D4) E45.3(I2) ; also sheet 1,2,5
P3_BD10: E15.13(D5) E45.10(I1) ; also sheet 1,2,5
P3_BD11: E15.14(D6) E45.13(I0) ; also sheet 1,2,5
P3_BF: E21.2(A:I1) E61.13(D:O) ; also sheet 4
P3_BINIT: E22.3(B:I) E53.13(D:O) ; also sheet 2,5,6
P3_BM0: E5.11(E:I) E11.2(B:O) E21.13(A:I2) ; also sheet 4
P3_BM1: E11.3(A:O) E21.1(A:I0) ; also sheet 4
P3_BM2: E5.13(F:I) E11.13(D:O) E14.21(I14) ; also sheet 6
P3_BM3: E7.11(E:I) E11.14(C:O) E14.22(I13)
P3_BM4: E7.13(F:I) E14.23(I12) E25.2(B:O) ; also sheet 4
P3_BM5: E14.24(I11) E25.3(A:O) ; also sheet 1,4
P3_BM6: E14.25(I10) E25.13(D:O) ; also sheet 1,4
P3_BM7: E14.26(I9) E25.14(C:O) ; also sheet 1,4
P3_BM8: E14.27(I8) E71.2(B:O) ; also sheet 1,4
P3_BM9: E14.2(I7) E44.11(E:I) E71.3(A:O) ; also sheet 1,4
P3_BM10: E14.3(I6) E71.13(D:O) ; also sheet 4
P3_BM11: E14.4(I5) E44.13(F:I) E71.14(C:O) ; also sheet 4
P3_BPAUSE: E14.5(I4) E26.16(/2:1Q) ; also sheet 5
P3_BPLA: E53.3(A:O) ; also sheet 4
P3_BTP1: E53.2(B:O) ; also sheet 6
P3_BTP2: E15.9(CLK) E17.9(CLK) E22.1(A:I) E27.9(C:I0) E53.14(C:O)
P3_BTP3: E6.1(A:I0) E38.3(A:O) ; also sheet 4,6
P3_BTP4: E27.12(A:O) ; also sheet 2,4,5,6
P3_BTS3: E20.12(D:I1) E51.13(D:O) ; also sheet 4
P3_BTS4: E6.10(C:I1) E20.2(A:I0) E26.3(/2:2D) E51.3(A:O) ; also sheet 2,5
P3_INIOEN: E14.10(O7) ; also sheet 4
P3_MBK: E4.11(D:I0) E4.12(D:I1) E6.9(C:I0) E19.2(A:I0) E19.3(A:I1) E19.5(B:I0) E19.6(B:I1) E20.3(A:I1) E60.9(B:Q)
P4_BTS1: E20.5(B:I0) ; also sheet 4,6
P4_LXA: E61.10(C:I1) E61.11(D:I0) ; also sheet 2,4,5
P6_BIND2: E20.6(B:I1) ; also sheet 6
P6_DIOI: E14.9(I0) ; also sheet 6
P6_EEM: E14.7(I2) ; also sheet 4,6
P6_RVFEN: E14.6(I3) ; also sheet 6
P6_USM: E14.8(I1) ; also sheet 1,4,5,6
PULSE_LA: E53.5(A:I1) U$1.DR2
TP1: E53.7(B:I1) U$1.CD2
TP2: E53.10(C:I1) U$1.CE2
TP3: E51.7(B:I1) U$1.CH2
TP4: E27.1(A:I0) E27.2(A:I1) E27.13(A:I2) U$1.CJ2
VCC: E26.5(/+UB:+UB) R1.1 R2.1 R6.1 R7.1 R8.1 R9.1 R10.2 R12.1 R24.1 R25.1 R26.1 R27.1 R31.1 ; also sheet 1,2,4,5,6
Unconnected: E26.1(/2:!1Q) E26.14(/2:!2Q) E60.8(B:!Q)

### Notes on the sheet
- AC Buffer
- Rearrange PLA
- AC Buffer
- Inst. Decode PLA
- KT8-A Memory Management Board
- D-CS-M8416-0-1 | D

## Sheet 4 of 7
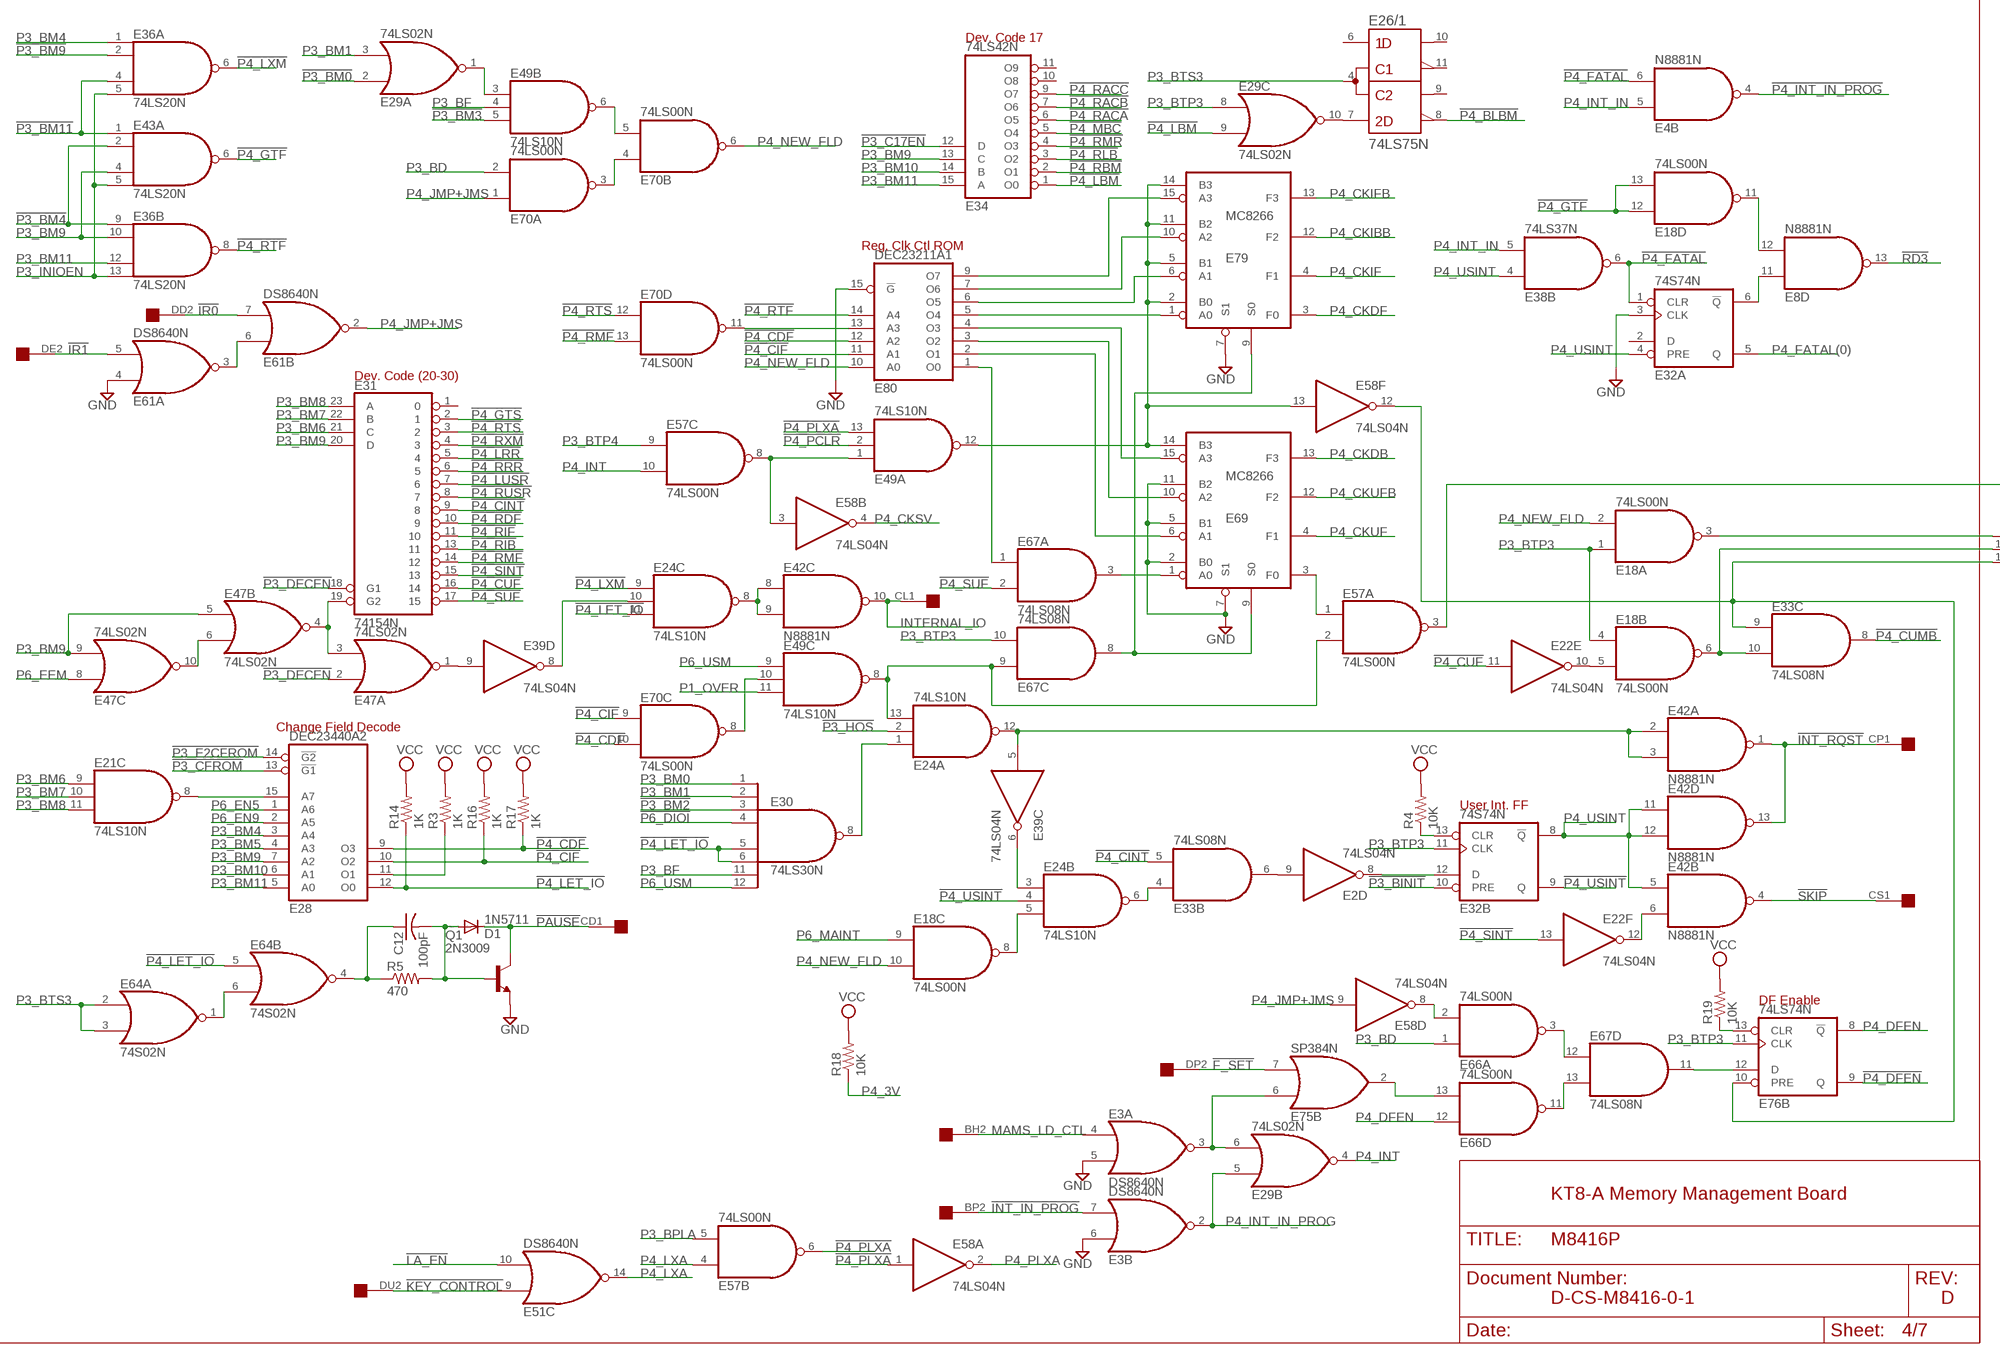
[diagram p4: schematic, sheet 4, part 1 of 2]
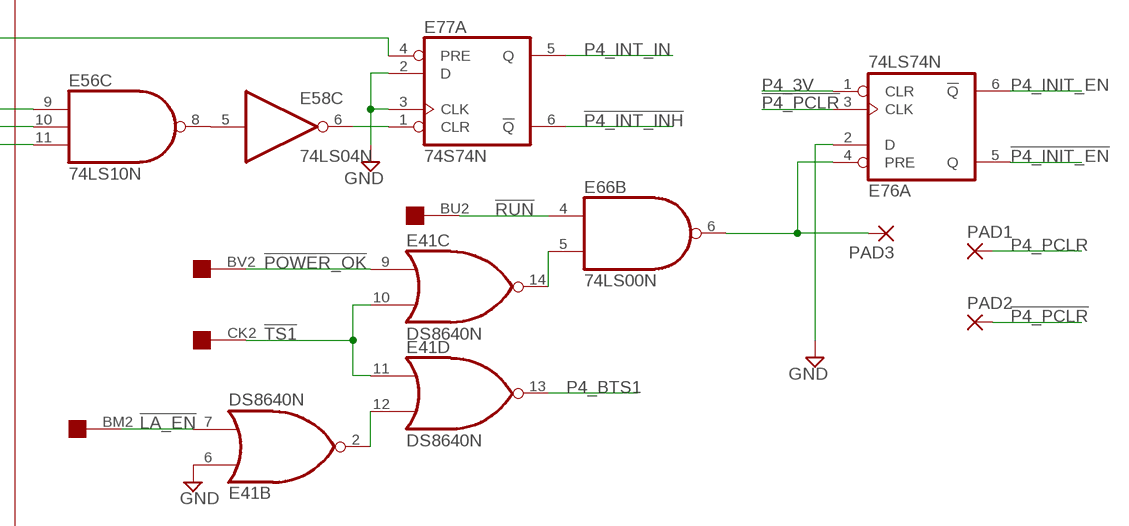
[diagram p5: schematic, sheet 4, part 2 of 2]

### Parts
C12  100pF  C-US  [C063-025X075]
D1  1N5711  DIODE-DO35-10  [DO35-10]
E3  DS8640N  [DIL14]
E8  N8881N  [DIL14]
E18  74LS00N  [DIL14]
E24  74LS10N  [DIL14]
E28  DEC23440A2  74S287  [DIL16]
E30  74LS30N  [DIL14]
E31  74154N  [DIL24-6]
E32  74S74N  [DIL14]
E34  74LS42N  [DIL16]
E36  74LS20N  [DIL14]
E42  N8881N  [DIL14]
E43  74LS20N  [DIL14]
E49  74LS10N  [DIL14]
E57  74LS00N  [DIL14]
E58  74LS04N  [DIL14]
E64  74S02N  [DIL14]
E66  74LS00N  [DIL14]
E69  MC8266  [DIL16]
E70  74LS00N  [DIL14]
E75  SP384N  [DIL14]
E76  74LS74N  [DIL14]
E77  74S74N  [DIL14]
E79  MC8266  [DIL16]
E80  DEC23211A1  74S288  [DIL16]
PAD1  1,6/0,8  [1,6/0,8]
PAD2  1,6/0,8  [1,6/0,8]
PAD3  1,6/0,8  [1,6/0,8]
Q1  2N3009  -NPN-TO5  [TO5]
R3  1K  R-US_0207/10  [0207/10]
R4  10K  R-US_0207/10  [0207/10]
R5  470  R-US_0207/10  [0207/10]
R14  1K  R-US_0207/10  [0207/10]
R16  1K  R-US_0207/10  [0207/10]
R17  1K  R-US_0207/10  [0207/10]
R18  10K  R-US_0207/10  [0207/10]
R19  10K  R-US_0207/10  [0207/10]

### Nets
!F_SET: E75.7(B:I1) U$1.DP2
!INT_IN_PROG: E3.7(B:I1) U$1.BP2
!INT_RQST: E42.1(A:O) E42.13(D:O) U$1.CP1
!IR0: E61.7(B:I1) U$1.DD2
!IR1: E61.5(A:I1) U$1.DE2
!KEY_CONTROL: E51.9(C:I0) U$1.DU2
!LA_EN: E41.7(B:I1) E51.10(C:I1) U$1.BM2
!P3_BINIT: E32.10(B:PRE) ; also sheet 3
!P3_BM0: E29.2(A:I0) ; also sheet 3
!P3_BM2: E30.3(I2) ; also sheet 3
!P3_BM3: E49.5(B:I2) ; also sheet 3
!P3_BM4: E36.9(B:I0) E43.2(A:I1) ; also sheet 3
!P3_BM9: E36.2(A:I1) ; also sheet 3
!P3_BM11: E36.4(A:I2) E43.1(A:I0) ; also sheet 3
!P3_C17EN: E34.12(D) ; also sheet 3
!P3_CFROM: E28.13(!G1) ; also sheet 3
!P3_DECEN: E31.18(G1) E47.2(A:I0) ; also sheet 3
!P3_E2CFROM: E28.14(!G2) ; also sheet 3
!P3_HOS: E24.2(A:I1) ; also sheet 3
!P4_BLBM: E26.8(/1:!2Q) ; also sheet 5
!P4_CDF: E28.9(O3) E70.10(C:I1) E80.12(A2) R17.1 ; also sheet 5
!P4_CIF: E28.10(O2) E70.9(C:I0) E80.11(A1) R16.1 ; also sheet 5
!P4_CINT: E31.9 E33.5(B:I1)
!P4_CUF: E22.11(E:I) E31.16
!P4_CUMB: E33.8(C:O) ; also sheet 6
!P4_DFEN: E76.9(B:Q) ; also sheet 2
!P4_FATAL: E4.6(B:I1) E32.1(A:CLR) E38.6(B:O)
!P4_GTF: E18.12(D:I0) E18.13(D:I1) E43.6(A:O) ; also sheet 2,6
!P4_GTS: E31.2 ; also sheet 2,6
!P4_INIT_EN: E76.5(A:Q) ; also sheet 5
!P4_INT_IN_PROG: E4.4(B:O) ; also sheet 5
!P4_INT_INH: E77.6(A:!Q) ; also sheet 6
!P4_LBM: E29.9(C:I1) E34.1(O0) ; also sheet 5
!P4_LET_IO: E24.11(C:I2) E28.12(O0) E30.5(I4) E30.6(I5) E64.5(B:I0) R14.1 ; also sheet 2
!P4_LRR: E31.5 ; also sheet 1
!P4_LUSR: E31.7 ; also sheet 1
!P4_LXM: E24.9(C:I0) E36.6(A:O) ; also sheet 6
!P4_MBC: E34.5(O4) ; also sheet 3
!P4_PCLR: E49.2(A:I1) E76.3(A:CLK) PAD2.1(P) ; also sheet 2,6
!P4_PLXA: E49.13(A:I2) E57.6(B:O) E58.1(A:I) ; also sheet 2
!P4_RACA: E34.6(O5) ; also sheet 3
!P4_RACB: E34.7(O6) ; also sheet 3
!P4_RACC: E34.9(O7) ; also sheet 3
!P4_RBM: E34.2(O1) ; also sheet 5
!P4_RDF: E31.10 ; also sheet 1,5
!P4_RIB: E31.13 ; also sheet 2
!P4_RIF: E31.11 ; also sheet 1
!P4_RLB: E34.3(O2) ; also sheet 5
!P4_RMF: E31.14 E70.13(D:I1) ; also sheet 2,5,6
!P4_RMR: E34.4(O3) ; also sheet 2,6
!P4_RRR: E31.6 ; also sheet 1
!P4_RTF: E36.8(B:O) E80.14(A4) ; also sheet 2
!P4_RTS: E31.3 E70.12(D:I0) ; also sheet 2,5
!P4_RUSR: E31.8 ; also sheet 1
!P4_RXM: E31.4 ; also sheet 6
!P4_SINT: E22.13(F:I) E31.15
!P4_SUF: E31.17 E67.2(A:I1) ; also sheet 6
!P4_USINT: E24.4(B:I1) E32.9(B:Q)
!P6_DIOI: E30.4(I3) ; also sheet 6
!PAUSE: D1.C Q1.3(C) U$1.CD1 ; also sheet 3
!POWER_OK: E41.9(C:I0) U$1.BV2
!RD3: E8.13(D:O) ; also sheet 3,5,6
!RUN: E66.4(B:I0) U$1.BU2
!SKIP: E42.4(B:O) U$1.CS1
!TS1: E41.10(C:I1) E41.11(D:I0) U$1.CK2
GND: E3.5(A:I1) E3.6(B:I0) E32.3(A:CLK) E41.6(B:I0) E61.4(A:I0) E69.2(B0) E69.5(B1) E69.7(S1) E69.11(B2) E76.2(A:D) E77.2(A:D) E77.3(A:CLK) E79.7(S1) E80.15(!G) Q1.1(E) ; also sheet 1,2,3,5,6
INTERNAL_IO: E42.10(C:O) U$1.CL1
MAMS_LD_CTL: E3.4(A:I0) U$1.BH2
N$16: E58.6(C:O) E77.1(A:CLR)
N$17: E56.8(C:O) E58.5(C:I)
N$28: E41.2(B:O) E41.12(D:I1)
N$29: E28.11(O1) R3.1
N$30: E64.1(A:O) E64.6(B:I1)
N$31: E41.14(C:O) E66.5(B:I1)
N$32: E24.1(A:I0) E30.8(O)
N$33: C12.1 E64.4(B:O) R5.1
N$34: C12.2 D1.A Q1.2(B) R5.2
N$37: E66.6(B:O) E76.4(A:PRE) PAD3.1(P)
N$89: E21.8(C:O) E28.15(A7)
N$90: E32.13(B:CLR) R4.1
N$91: E76.13(B:CLR) R19.1
N$92: E24.13(A:I2) E49.8(C:O) E57.2(A:I1) E67.9(C:I0)
N$93: E49.10(C:I1) E70.8(C:O)
N$94: E22.12(F:O) E42.6(B:I1)
N$95: E2.8(D:O) E32.12(B:D)
N$96: E2.9(D:I) E33.6(B:O)
N$97: E24.6(B:O) E33.4(B:I0)
N$98: E18.8(C:O) E24.5(B:I2)
N$99: E47.6(B:I1) E47.10(C:O)
N$100: E31.19(G2) E47.3(A:I1) E47.4(B:O)
N$101: E39.9(D:I) E47.1(A:O)
N$102: E24.3(B:I0) E39.6(C:O)
N$103: E24.12(A:O) E39.5(C:I) E42.2(A:I0) E42.3(A:I1)
N$104: E67.11(D:O) E76.12(B:D)
N$105: E66.11(D:O) E67.13(D:I1)
N$106: E66.3(A:O) E67.12(D:I0)
N$107: E58.8(D:O) E66.2(A:I1)
N$108: E3.3(A:O) E29.6(B:I1) E75.6(B:I0)
N$109: E66.13(D:I1) E75.2(B:O)
N$110: E49.1(A:I0) E57.8(C:O) E58.3(B:I)
N$111: E67.8(C:O) E69.9(S0) E79.9(S0)
N$112: E49.12(A:O) E58.13(F:I) E69.14(B3) E79.2(B0) E79.5(B1) E79.11(B2) E79.14(B3)
N$113: E49.6(B:O) E70.5(B:I1)
N$114: E79.15(A3) E80.9(O7)
N$115: E79.10(A2) E80.7(O6)
N$116: E79.6(A1) E80.6(O5)
N$117: E79.1(A0) E80.5(O4)
N$118: E69.15(A3) E80.4(O3)
N$119: E69.10(A2) E80.3(O2)
N$120: E69.6(A1) E80.2(O1)
N$121: E67.1(A:I0) E80.1(O0)
N$122: E67.3(A:O) E69.1(A0)
N$123: E70.3(A:O) E70.4(B:I0)
N$124: E29.1(A:O) E49.3(B:I0)
N$125: E70.11(D:O) E80.13(A3)
N$126: E24.10(C:I1) E39.8(D:O)
N$127: E61.3(A:O) E61.6(B:I0)
N$128: E24.8(C:O) E42.8(C:I0) E42.9(C:I1)
N$129: E57.3(A:O) E77.4(A:PRE)
N$130: E26.7(/1:2D) E29.10(C:O)
N$131: E8.12(D:I1) E18.11(D:O)
N$132: E8.11(D:I0) E32.6(A:!Q)
N$133: E57.1(A:I0) E69.3(F0)
N$134: E33.9(C:I0) E56.11(C:I2) E58.12(F:O) E76.10(B:PRE)
N$135: E18.3(A:O) E56.9(C:I0)
N$136: E18.6(B:O) E33.10(C:I1) E56.10(C:I1)
N$138: E18.5(B:I1) E22.10(E:O)
P1_OVER: E49.11(C:I2) ; also sheet 1
P3_BD: E66.1(A:I0) E70.2(A:I1) ; also sheet 3
P3_BF: E30.11(I6) E49.4(B:I1) ; also sheet 3
P3_BM0: E30.1(I0) ; also sheet 3
P3_BM1: E29.3(A:I1) E30.2(I1) ; also sheet 3
P3_BM4: E28.3(A4) E36.1(A:I0) ; also sheet 3
P3_BM5: E28.4(A3) ; also sheet 1,3
P3_BM6: E21.9(C:I0) E31.21(C) ; also sheet 1,3
P3_BM7: E21.10(C:I1) E31.22(B) ; also sheet 1,3
P3_BM8: E21.11(C:I2) E31.23(A) ; also sheet 1,3
P3_BM9: E28.7(A2) E31.20(D) E34.13(C) E36.10(B:I1) E43.4(A:I2) E47.5(B:I0) E47.9(C:I1) ; also sheet 1,3
P3_BM10: E28.6(A1) E34.14(B) ; also sheet 3
P3_BM11: E28.5(A0) E34.15(A) E36.12(B:I2) ; also sheet 3
P3_BPLA: E57.5(B:I1) ; also sheet 3
P3_BTP3: E18.1(A:I0) E18.4(B:I0) E29.8(C:I0) E32.11(B:CLK) E67.10(C:I1) E76.11(B:CLK) ; also sheet 3,6
P3_BTP4: E57.9(C:I0) ; also sheet 2,3,5,6
P3_BTS3: E26.4(/1:1C,2C) E64.2(A:I0) E64.3(A:I1) ; also sheet 3
P3_INIOEN: E36.5(A:I3) E36.13(B:I3) E43.5(A:I3) ; also sheet 3
P4_3V: E76.1(A:CLR) R18.1
P4_BTS1: E41.13(D:O) ; also sheet 3,6
P4_CKDB: E69.13(F3) ; also sheet 5
P4_CKDF: E79.3(F0) ; also sheet 2
P4_CKIBB: E79.12(F2) ; also sheet 5
P4_CKIF: E79.4(F1) ; also sheet 2,5
P4_CKIFB: E79.13(F3) ; also sheet 2
P4_CKSV: E58.4(B:O) ; also sheet 2,5,6
P4_CKUF: E69.4(F1) ; also sheet 6
P4_CKUFB: E69.12(F2) ; also sheet 6
P4_DFEN: E66.12(D:I0) E76.8(B:!Q) ; also sheet 2,5
P4_FATAL(0): E32.5(A:Q) ; also sheet 6
P4_INIT_EN: E76.6(A:!Q) ; also sheet 2
P4_INT: E29.4(B:O) E57.10(C:I1) ; also sheet 2
P4_INT_IN: E4.5(B:I0) E38.5(B:I1) E77.5(A:Q)
P4_INT_IN_PROG: E3.2(B:O) E29.5(B:I0)
P4_JMP+JMS: E58.9(D:I) E61.2(B:O) E70.1(A:I0)
P4_LXA: E51.14(C:O) E57.4(B:I0) ; also sheet 2,3,5
P4_NEW_FLD: E18.2(A:I1) E18.10(C:I1) E70.6(B:O) E80.10(A0) ; also sheet 2,5,6
P4_PCLR: PAD1.1(P) ; also sheet 2,6
P4_PLXA: E58.2(A:O) ; also sheet 2,6
P4_USINT: E32.4(A:PRE) E32.8(B:!Q) E38.4(B:I0) E42.5(B:I0) E42.11(D:I0) E42.12(D:I1)
P6_EEM: E47.8(C:I0) ; also sheet 3,6
P6_EN5: E28.1(A6) ; also sheet 6
P6_EN9: E28.2(A5) ; also sheet 6
P6_MAINT: E18.9(C:I0) ; also sheet 6
P6_USM: E30.12(I7) E49.9(C:I0) ; also sheet 1,3,5,6
VCC: R3.2 R4.2 R14.2 R16.2 R17.2 R18.2 R19.2 ; also sheet 1,2,3,5,6
Unconnected: E26.6(/1:1D) E26.9(/1:2Q) E26.10(/1:1Q) E26.11(/1:!1Q) E30.9(P) E30.10(P) E30.13(P) E31.1 E32.2(A:D) E34.10(O8) E34.11(O9)

### Notes on the sheet
- Dev. Code 17
- Reg. Clk Ctl ROM
- Dev. Code (20-30)
- Change Field Decode
- User Int. FF
- DF Enable
- KT8-A Memory Management Board
- D-CS-M8416-0-1 | D

## Sheet 5 of 7
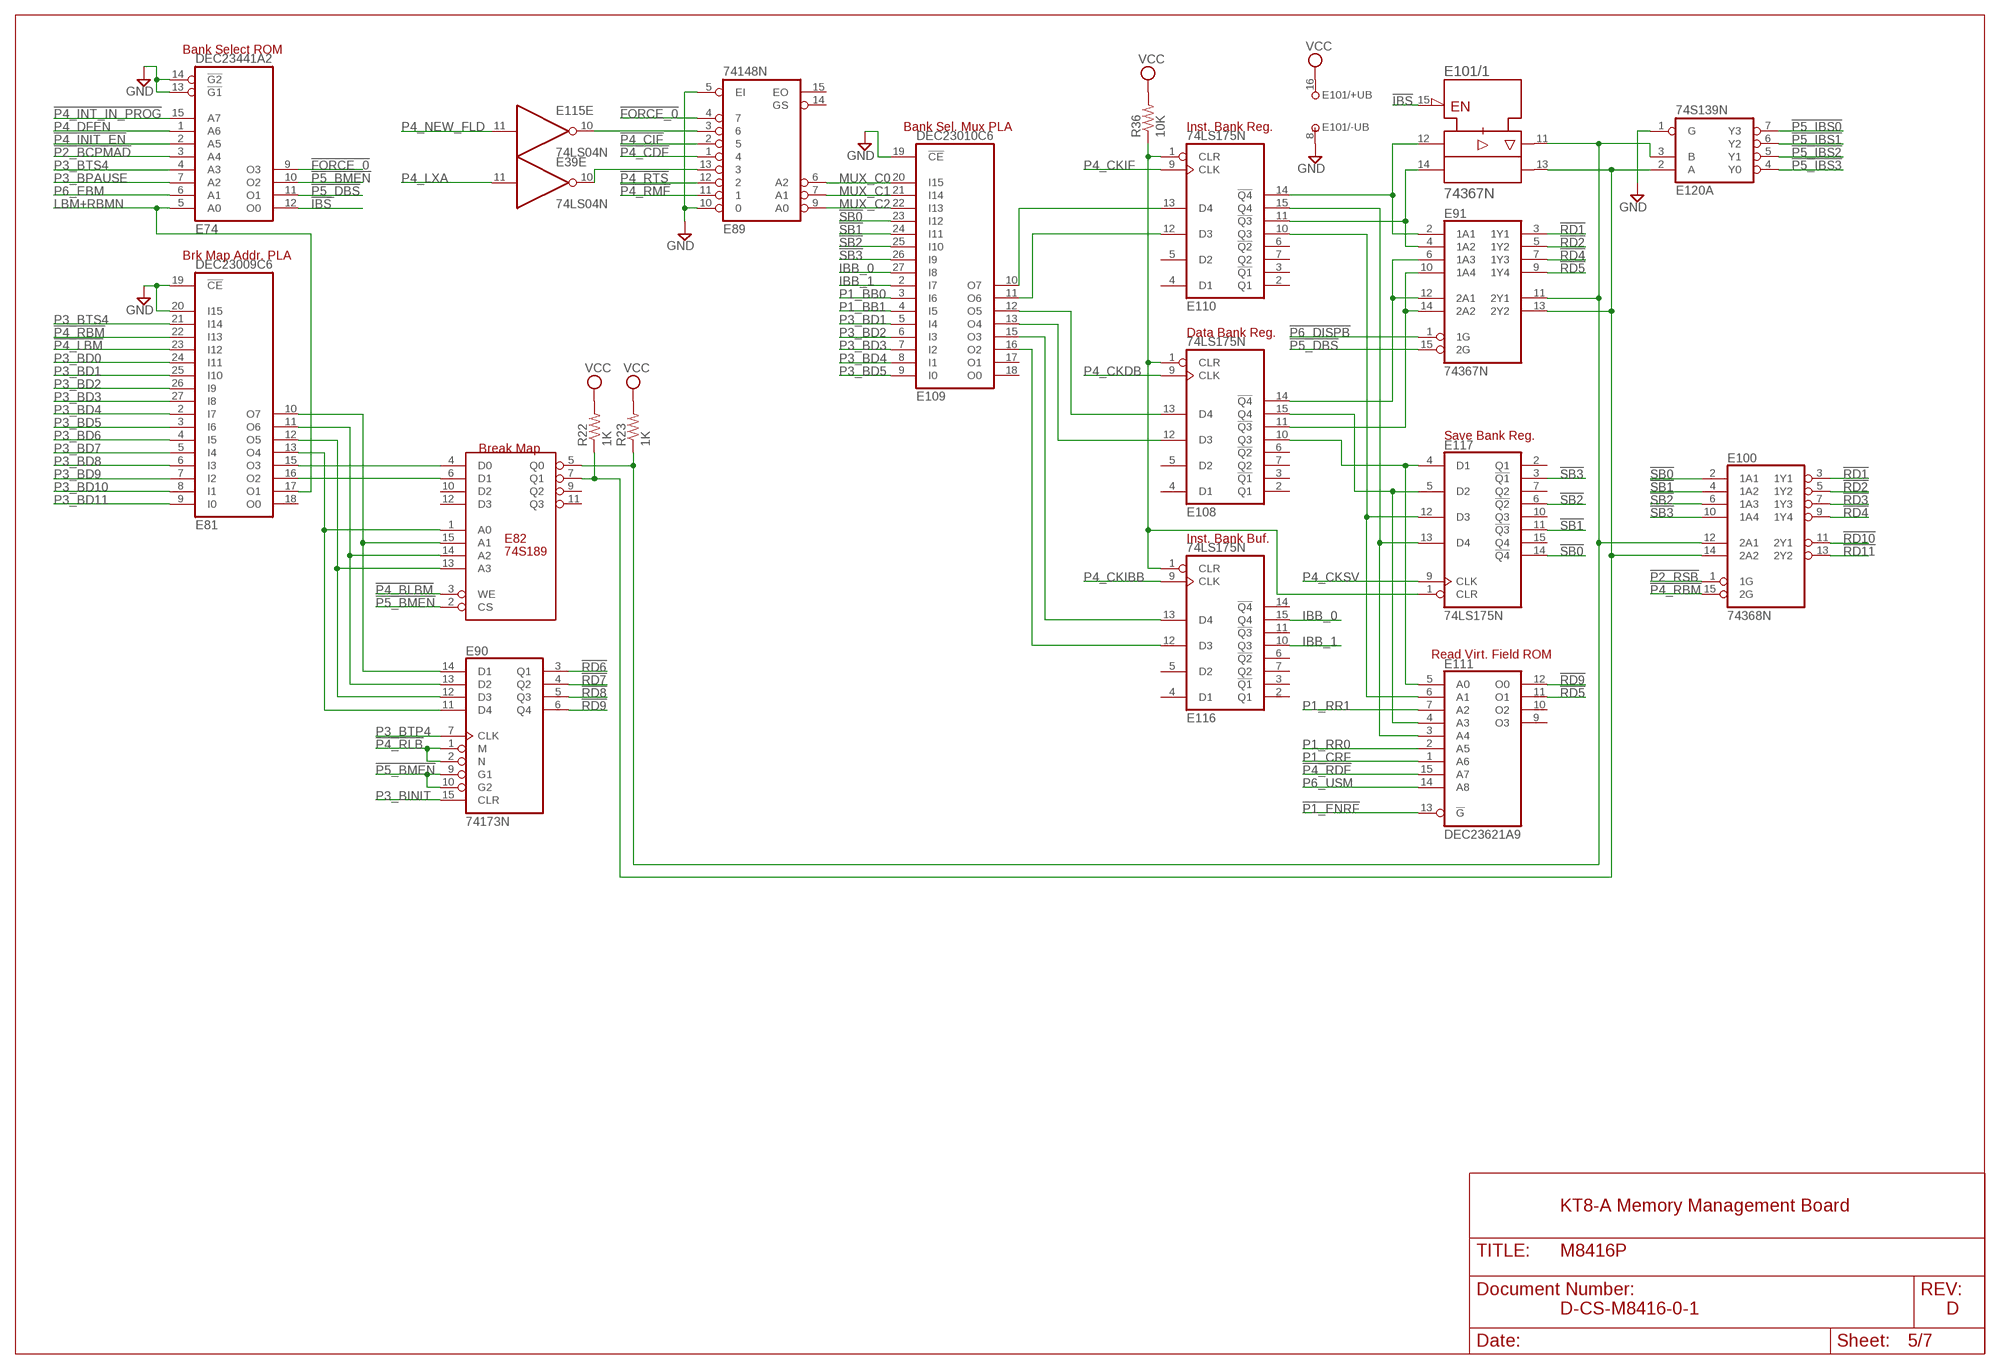
[diagram p6: schematic, sheet 5]

### Parts
E74  DEC23441A2  74S287  [DIL16]
E81  DEC23009C6  82S100  [DIL28]
E82  74S189  7489  [DIL16]
E89  74148N  [DIL16]
E90  74173N  74LS173N  [DIL16]
E91  74367N  [DIL16]
E100  74368N  [DIL16]
E108  74LS175N  [DIL16]
E109  DEC23010C6  82S100  [DIL28]
E110  74LS175N  [DIL16]
E111  DEC23621A9  74S571  [DIL16]
E116  74LS175N  [DIL16]
E117  74LS175N  [DIL16]
E120  74S139N  [DIL16]
R22  1K  R-US_0207/10  [0207/10]
R23  1K  R-US_0207/10  [0207/10]
R36  10K  R-US_0207/10  [0207/10]

### Nets
!FORCE_0: E74.9(O3) E89.4
!IBS: E74.12(O0) E101.15(/1:!G)
!P1_ENRF: E111.13(!G) ; also sheet 1,6
!P2_BCPMAD: E74.3(A4) ; also sheet 2
!P2_RSB: E100.1(1G) ; also sheet 2
!P4_BLBM: E82.3(WE) ; also sheet 4
!P4_CDF: E89.1 ; also sheet 4
!P4_CIF: E89.2 ; also sheet 4
!P4_INIT_EN: E74.2(A5) ; also sheet 4
!P4_INT_IN_PROG: E74.15(A7) ; also sheet 4
!P4_LBM: E81.23(I12) ; also sheet 4
!P4_RBM: E81.22(I13) E100.15(2G) ; also sheet 4
!P4_RDF: E111.15(A7) ; also sheet 1,4
!P4_RLB: E90.1(M) E90.2(N) ; also sheet 4
!P4_RMF: E89.11 ; also sheet 2,4,6
!P4_RTS: E89.12 ; also sheet 2,4
!P5_BMEN: E74.10(O2) E82.2(CS) E90.9(G1) E90.10(G2) ; also sheet 6
!P5_DBS: E74.11(O1) E91.15(2G) ; also sheet 6
!P5_IBS0: E120.7(A:Y3) ; also sheet 6
!P5_IBS1: E120.6(A:Y2) ; also sheet 6
!P5_IBS2: E120.5(A:Y1) ; also sheet 6
!P5_IBS3: E120.4(A:Y0) ; also sheet 6
!P6_DISPB: E91.1(1G) ; also sheet 6
!RD1: E91.3(1Y1) E100.3(1Y1) ; also sheet 3,6
!RD2: E91.5(1Y2) E100.5(1Y2) ; also sheet 3,6
!RD3: E100.7(1Y3) ; also sheet 3,4,6
!RD4: E91.7(1Y3) E100.9(1Y4) ; also sheet 3,6
!RD5: E91.9(1Y4) E111.11(O1) ; also sheet 3,6
!RD6: E90.3(Q1) ; also sheet 1,2,3,6
!RD7: E90.4(Q2) ; also sheet 1,2,3,6
!RD8: E90.5(Q3) ; also sheet 1,2,3,6
!RD9: E90.6(Q4) E111.12(O0) ; also sheet 1,2,3
!RD10: E100.11(2Y1) ; also sheet 1,2,3
!RD11: E100.13(2Y2) ; also sheet 1,2,3
!SB0: E100.2(1A1) E109.23(I12) E117.14(!Q4)
!SB1: E100.4(1A2) E109.24(I11) E117.11(!Q3)
!SB2: E100.6(1A3) E109.25(I10) E117.6(!Q2)
!SB3: E100.10(1A4) E109.26(I9) E117.3(!Q1)
GND: E74.13(!G1) E74.14(!G2) E81.19(!CE) E81.20(I15) E89.5(EI) E89.10 E101.8(/-UB:-UB) E109.19(!CE) E120.1(A:G) ; also sheet 1,2,3,4,6
IBB_0: E109.27(I8) E116.15(Q4)
IBB_1: E109.2(I7) E116.10(Q3)
LBM+RBMN: E74.5(A0) E81.17(O1)
MUX_C0: E89.6(A2) E109.20(I15)
MUX_C1: E89.7(A1) E109.21(I14)
MUX_C2: E89.9(A0) E109.22(I13)
N$139: E81.10(O7) E82.15(A1) E90.14(D1)
N$140: E81.11(O6) E82.14(A2) E90.13(D2)
N$141: E81.12(O5) E82.13(A3) E90.12(D3)
N$142: E81.13(O4) E82.1(A0) E90.11(D4)
N$143: E81.15(O3) E82.4(D0)
N$144: E81.16(O2) E82.6(D1)
N$145: E82.7(Q1) E91.13(2Y2) E100.14(2A2) E101.13(/1:Y2) E120.2(A:A) R22.1
N$146: E82.5(Q0) E91.11(2Y1) E100.12(2A1) E101.11(/1:Y1) E120.3(A:B) R23.1
N$147: E89.3 E115.10(E:O)
N$148: E39.10(E:O) E89.13
N$149: E109.10(O7) E110.13(D4)
N$150: E109.11(O6) E110.12(D3)
N$151: E108.13(D4) E109.12(O5)
N$152: E108.12(D3) E109.13(O4)
N$153: E109.15(O3) E116.13(D4)
N$154: E109.16(O2) E116.12(D3)
N$155: E108.1(CLR) E110.1(CLR) E116.1(CLR) E117.1(CLR) R36.1
N$156: E91.2(1A1) E101.12(/1:A1) E110.14(!Q4)
N$157: E110.10(Q3) E111.6(A1) E117.12(D3)
N$158: E91.4(1A2) E101.14(/1:A2) E110.11(!Q3)
N$159: E110.15(Q4) E111.3(A4) E117.13(D4)
N$160: E91.6(1A3) E91.12(2A1) E108.14(!Q4)
N$161: E91.10(1A4) E91.14(2A2) E108.11(!Q3)
N$162: E108.10(Q3) E111.5(A0) E117.4(D1)
N$163: E108.15(Q4) E111.4(A3) E117.5(D2)
P1_BB0: E109.3(I6) ; also sheet 1
P1_BB1: E109.4(I5) ; also sheet 1
P1_CRF: E111.1(A6) ; also sheet 1
P1_RR0: E111.2(A5) ; also sheet 1
P1_RR1: E111.7(A2) ; also sheet 1
P3_BD0: E81.24(I11) ; also sheet 3,6
P3_BD1: E81.25(I10) E109.5(I4) ; also sheet 3,6
P3_BD2: E81.26(I9) E109.6(I3) ; also sheet 3,6
P3_BD3: E81.27(I8) E109.7(I2) ; also sheet 3,6
P3_BD4: E81.2(I7) E109.8(I1) ; also sheet 3,6
P3_BD5: E81.3(I6) E109.9(I0) ; also sheet 3,6
P3_BD6: E81.4(I5) ; also sheet 1,2,3,6
P3_BD7: E81.5(I4) ; also sheet 1,2,3
P3_BD8: E81.6(I3) ; also sheet 1,2,3
P3_BD9: E81.7(I2) ; also sheet 1,2,3
P3_BD10: E81.8(I1) ; also sheet 1,2,3
P3_BD11: E81.9(I0) ; also sheet 1,2,3
P3_BINIT: E90.15(CLR) ; also sheet 2,3,6
P3_BPAUSE: E74.7(A2) ; also sheet 3
P3_BTP4: E90.7(CLK) ; also sheet 2,3,4,6
P3_BTS4: E74.4(A3) E81.21(I14) ; also sheet 2,3
P4_CKDB: E108.9(CLK) ; also sheet 4
P4_CKIBB: E116.9(CLK) ; also sheet 4
P4_CKIF: E110.9(CLK) ; also sheet 2,4
P4_CKSV: E117.9(CLK) ; also sheet 2,4,6
P4_DFEN: E74.1(A6) ; also sheet 2,4
P4_LXA: E39.11(E:I) ; also sheet 2,3,4
P4_NEW_FLD: E115.11(E:I) ; also sheet 2,4,6
P6_EBM: E74.6(A1) ; also sheet 6
P6_USM: E111.14(A8) ; also sheet 1,3,4,6
VCC: E101.16(/+UB:+UB) R22.2 R23.2 R36.2 ; also sheet 1,2,3,4,6
Unconnected: E81.18(O0) E82.9(Q2) E82.10(D2) E82.11(Q3) E82.12(D3) E89.14(GS) E89.15(EO) E108.2(Q1) E108.3(!Q1) E108.4(D1) E108.5(D2) E108.6(!Q2) E108.7(Q2) E109.17(O1) E109.18(O0) E110.2(Q1) E110.3(!Q1) E110.4(D1) E110.5(D2) E110.6(!Q2) E110.7(Q2) E111.9(O3) E111.10(O2) E116.2(Q1) E116.3(!Q1) E116.4(D1) E116.5(D2) E116.6(!Q2) E116.7(Q2) E116.11(!Q3) E116.14(!Q4) E117.2(Q1) E117.7(Q2) E117.10(Q3) E117.15(Q4)

### Notes on the sheet
- Bank Select ROM
- Bank Sel. Mux PLA | Inst. Bank Reg.
- Brk Map Addr. PLA
- Data Bank Reg.
- Save Bank Reg.
- Break Map
- Inst. Bank Buf.
- Read Virt. Field ROM
- KT8-A Memory Management Board
- D-CS-M8416-0-1 | D

## Sheet 6 of 7
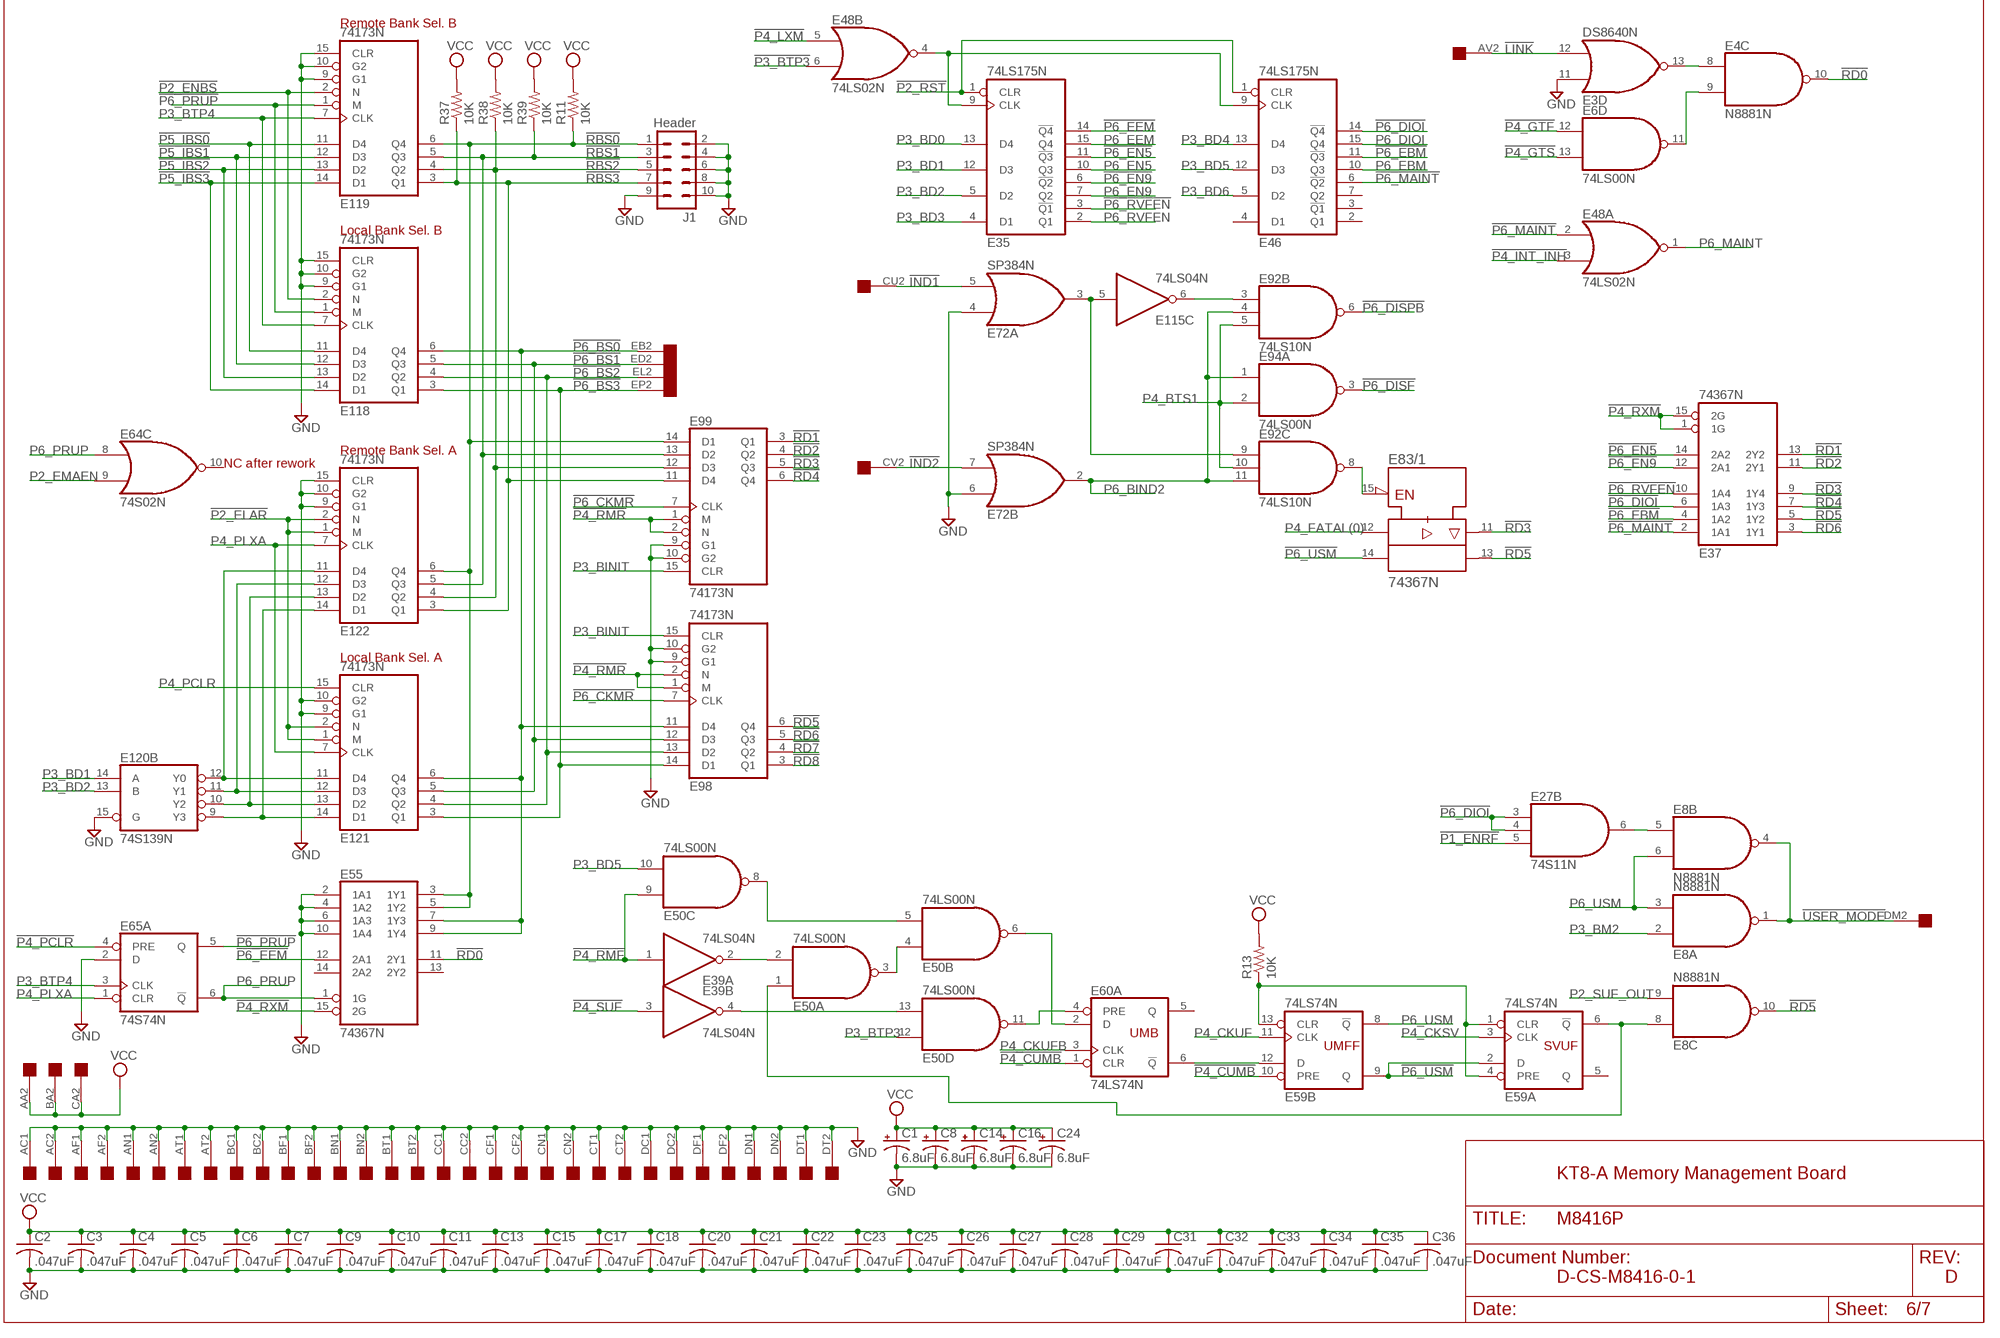
[diagram p7: schematic, sheet 6, part 1 of 2]
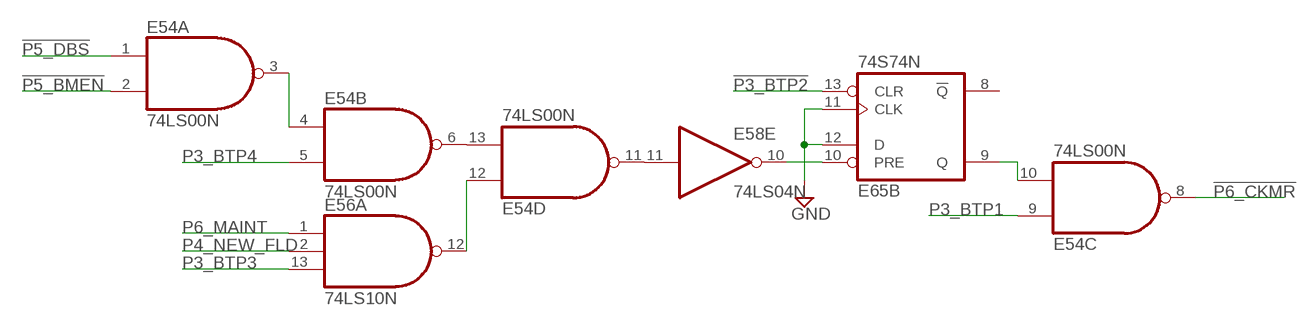
[diagram p8: schematic, sheet 6, part 2 of 2]

### Parts
C1  6.8uF  CPOL-USE20-8AXIAL  [E12-8]
C2  .047uF  C-US102-043X133  [C102-043X133]
C3  .047uF  C-US102-043X133  [C102-043X133]
C4  .047uF  C-US102-043X133  [C102-043X133]
C5  .047uF  C-US102-043X133  [C102-043X133]
C6  .047uF  C-US102-043X133  [C102-043X133]
C7  .047uF  C-US102-043X133  [C102-043X133]
C8  6.8uF  CPOL-USE20-8AXIAL  [E12-8]
C9  .047uF  C-US102-043X133  [C102-043X133]
C10  .047uF  C-US102-043X133  [C102-043X133]
C11  .047uF  C-US102-043X133  [C102-043X133]
C13  .047uF  C-US102-043X133  [C102-043X133]
C14  6.8uF  CPOL-USE20-8AXIAL  [E12-8]
C15  .047uF  C-US102-043X133  [C102-043X133]
C16  6.8uF  CPOL-USE20-8AXIAL  [E12-8]
C17  .047uF  C-US102-043X133  [C102-043X133]
C18  .047uF  C-US102-043X133  [C102-043X133]
C20  .047uF  C-US102-043X133  [C102-043X133]
C21  .047uF  C-US102-043X133  [C102-043X133]
C22  .047uF  C-US102-043X133  [C102-043X133]
C23  .047uF  C-US102-043X133  [C102-043X133]
C24  6.8uF  CPOL-USE20-8AXIAL  [E12-8]
C25  .047uF  C-US102-043X133  [C102-043X133]
C26  .047uF  C-US102-043X133  [C102-043X133]
C27  .047uF  C-US102-043X133  [C102-043X133]
C28  .047uF  C-US102-043X133  [C102-043X133]
C29  .047uF  C-US102-043X133  [C102-043X133]
C31  .047uF  C-US102-043X133  [C102-043X133]
C32  .047uF  C-US102-043X133  [C102-043X133]
C33  .047uF  C-US102-043X133  [C102-043X133]
C34  .047uF  C-US102-043X133  [C102-043X133]
C35  .047uF  C-US102-043X133  [C102-043X133]
C36  .047uF  C-US102-043X133  [C102-043X133]
E35  74LS175N  [DIL16]
E37  74367N  [DIL16]
E46  74LS175N  [DIL16]
E50  74LS00N  [DIL14]
E54  74LS00N  [DIL14]
E55  74367N  [DIL16]
E59  74LS74N  [DIL14]
E65  74S74N  [DIL14]
E72  SP384N  [DIL14]
E98  74173N  74LS173N  [DIL16]
E99  74173N  74LS173N  [DIL16]
E118  74173N  74LS173N  [DIL16]
E119  74173N  74LS173N  [DIL16]
E121  74173N  74LS173N  [DIL16]
E122  74173N  74LS173N  [DIL16]
J1  Header  10H  [10H]
R11  10K  R-US_0207/10  [0207/10]
R13  10K  R-US_0207/10  [0207/10]
R37  10K  R-US_0207/10  [0207/10]
R38  10K  R-US_0207/10  [0207/10]
R39  10K  R-US_0207/10  [0207/10]

### Nets
!IND1: E72.5(A:I1) U$1.CU2
!IND2: E72.7(B:I1) U$1.CV2
!LINK: E3.12(D:I1) U$1.AV2
!P1_ENRF: E27.5(B:I2) ; also sheet 1,5
!P2_ELAR: E121.1(M) E121.2(N) E122.1(M) E122.2(N) ; also sheet 2
!P2_ENBS: E118.2(N) E119.2(N) ; also sheet 2
!P2_RST: E35.1(CLR) E46.1(CLR) ; also sheet 1,2
!P3_BTP2: E65.13(B:CLR) ; also sheet 3
!P3_BTP3: E48.6(B:I1) ; also sheet 1,3
!P4_CUMB: E59.10(B:PRE) E60.1(A:CLR) ; also sheet 4
!P4_GTF: E6.12(D:I0) ; also sheet 2,4
!P4_GTS: E6.13(D:I1) ; also sheet 2,4
!P4_INT_INH: E48.3(A:I1) ; also sheet 4
!P4_LXM: E48.5(B:I0) ; also sheet 4
!P4_PCLR: E65.4(A:PRE) ; also sheet 2,4
!P4_RMF: E39.1(A:I) E50.9(C:I0) ; also sheet 2,4,5
!P4_RMR: E98.1(M) E98.2(N) E99.1(M) E99.2(N) ; also sheet 2,4
!P4_RXM: E37.1(1G) E37.15(2G) E55.15(2G) ; also sheet 4
!P4_SUF: E39.3(B:I) ; also sheet 4
!P5_BMEN: E54.2(A:I1) ; also sheet 5
!P5_DBS: E54.1(A:I0) ; also sheet 5
!P5_IBS0: E118.11(D4) E119.11(D4) ; also sheet 5
!P5_IBS1: E118.12(D3) E119.12(D3) ; also sheet 5
!P5_IBS2: E118.13(D2) E119.13(D2) ; also sheet 5
!P5_IBS3: E118.14(D1) E119.14(D1) ; also sheet 5
!P6_BS0: E55.7(1Y3) E55.9(1Y4) E98.11(D4) E118.6(Q4) E121.6(Q4) U$1.EB2
!P6_BS1: E98.12(D3) E118.5(Q3) E121.5(Q3) U$1.ED2
!P6_BS2: E98.13(D2) E118.4(Q2) E121.4(Q2) U$1.EL2
!P6_BS3: E98.14(D1) E118.3(Q1) E121.3(Q1) U$1.EP2
!P6_CKMR: E54.8(C:O) E98.7(CLK) E99.7(CLK) ; also sheet 2
!P6_DIOI: E27.3(B:I0) E27.4(B:I1) E37.6(1A3) E46.14(!Q4) ; also sheet 4
!P6_DISF: E94.3(A:O) ; also sheet 2
!P6_DISPB: E92.6(B:O) ; also sheet 5
!P6_EBM: E37.4(1A2) E46.11(!Q3)
!P6_EEM: E35.14(!Q4) E55.12(2A1)
!P6_EN5: E35.11(!Q3) E37.14(2A2)
!P6_EN9: E35.6(!Q2) E37.12(2A1)
!P6_MAINT: E37.2(1A1) E46.6(!Q2) E48.2(A:I0)
!P6_PRUP: E65.5(A:Q) E118.1(M) E119.1(M)
!P6_RVFEN: E35.3(!Q1) E37.10(1A4)
!P6_USM: E59.2(A:D) E59.9(B:Q) E83.14(/1:A2)
!RBS0: E55.3(1Y1) E55.5(1Y2) E99.14(D1) E119.6(Q4) E122.6(Q4) J1.1 R11.1
!RBS1: E99.13(D2) E119.5(Q3) E122.5(Q3) J1.3 R39.1
!RBS2: E99.12(D3) E119.4(Q2) E122.4(Q2) J1.5 R38.1
!RBS3: E99.11(D4) E119.3(Q1) E122.3(Q1) J1.7 R37.1
!RD0: E4.10(C:O) E55.11(2Y1) ; also sheet 3
!RD1: E37.13(2Y2) E99.3(Q1) ; also sheet 3,5
!RD2: E37.11(2Y1) E99.4(Q2) ; also sheet 3,5
!RD3: E37.9(1Y4) E83.11(/1:Y1) E99.5(Q3) ; also sheet 3,4,5
!RD4: E37.7(1Y3) E99.6(Q4) ; also sheet 3,5
!RD5: E8.10(C:O) E37.5(1Y2) E83.13(/1:Y2) E98.6(Q4) ; also sheet 3,5
!RD6: E37.3(1Y1) E98.5(Q3) ; also sheet 1,2,3,5
!RD7: E98.4(Q2) ; also sheet 1,2,3,5
!RD8: E98.3(Q1) ; also sheet 1,2,3,5
!USER_MODE: E8.1(A:O) E8.4(B:O) U$1.DM2
GND: C1.- C2.2 C3.2 C4.2 C5.2 C6.2 C7.2 C8.- C9.2 C10.2 C11.2 C13.2 C14.- C15.2 C16.- C17.2 C18.2 C20.2 C21.2 C22.2 C23.2 C24.- C25.2 C26.2 C27.2 C28.2 C29.2 C31.2 C32.2 C33.2 C34.2 C35.2 C36.2 E3.11(D:I0) E55.2(1A1) E55.4(1A2) E55.6(1A3) E55.10(1A4) E65.2(A:D) E65.11(B:CLK) E65.12(B:D) E72.4(A:I0) E72.6(B:I0) E98.9(G1) E98.10(G2) E99.9(G1) E99.10(G2) E118.9(G1) E118.10(G2) E118.15(CLR) E119.9(G1) E119.10(G2) E119.15(CLR) E120.15(B:G) E121.9(G1) E121.10(G2) E122.9(G1) E122.10(G2) E122.15(CLR) J1.2 J1.4 J1.6 J1.8 J1.9 J1.10 U$1.AC1 U$1.AC2 U$1.AF1 U$1.AF2 U$1.AN1 U$1.AN2 U$1.AT1 U$1.AT2 U$1.BC1 U$1.BC2 U$1.BF1 U$1.BF2 U$1.BN1 U$1.BN2 U$1.BT1 U$1.BT2 U$1.CC1 U$1.CC2 U$1.CF1 U$1.CF2 U$1.CN1 U$1.CN2 U$1.CT1 U$1.CT2 U$1.DC1 U$1.DC2 U$1.DF1 U$1.DF2 U$1.DN1 U$1.DN2 U$1.DT1 U$1.DT2 ; also sheet 1,2,3,4,5
N$4: E54.11(D:O) E58.11(E:I)
N$7: E58.10(E:O) E65.10(B:PRE)
N$21: E120.12(B:Y0) E121.11(D4) E122.11(D4)
N$23: E120.11(B:Y1) E121.12(D3) E122.12(D3)
N$24: E120.10(B:Y2) E121.13(D2) E122.13(D2)
N$25: E120.9(B:Y3) E121.14(D1) E122.14(D1)
N$26: E3.13(D:O) E4.8(C:I0)
N$27: E4.9(C:I1) E6.11(D:O)
N$164: E35.9(CLK) E46.9(CLK) E48.4(B:O)
N$165: E72.3(A:O) E92.9(C:I0) E115.5(C:I)
N$166: E92.3(B:I0) E115.6(C:O)
N$168: E8.8(C:I0) E50.1(A:I0) E59.6(A:!Q)
N$169: E83.15(/1:!G) E92.8(C:O)
N$170: E39.2(A:O) E50.2(A:I1)
N$171: E39.4(B:O) E50.13(D:I1)
N$172: E50.3(A:O) E50.4(B:I0)
N$173: E50.5(B:I1) E50.8(C:O)
N$174: E50.6(B:O) E60.2(A:D)
N$175: E50.11(D:O) E60.4(A:PRE)
N$176: E59.12(B:D) E60.6(A:!Q)
N$177: E59.1(A:CLR) E59.4(A:PRE) E59.13(B:CLR) R13.1
N$178: E54.3(A:O) E54.4(B:I0)
N$179: E8.5(B:I0) E27.6(B:O)
N$180: E54.6(B:O) E54.13(D:I1)
N$181: E54.12(D:I0) E56.12(A:O)
N$183: E54.10(C:I1) E65.9(B:Q)
P2_EMAEN: E64.9(C:I1) ; also sheet 2
P2_SUF_OUT: E8.9(C:I1) ; also sheet 2
P3_BD0: E35.13(D4) ; also sheet 3,5
P3_BD1: E35.12(D3) E120.14(B:A) ; also sheet 3,5
P3_BD2: E35.5(D2) E120.13(B:B) ; also sheet 3,5
P3_BD3: E35.4(D1) ; also sheet 3,5
P3_BD4: E46.13(D4) ; also sheet 3,5
P3_BD5: E46.12(D3) E50.10(C:I1) ; also sheet 3,5
P3_BD6: E46.5(D2) ; also sheet 1,2,3,5
P3_BINIT: E98.15(CLR) E99.15(CLR) ; also sheet 2,3,5
P3_BM2: E8.2(A:I0) ; also sheet 3
P3_BTP1: E54.9(C:I0) ; also sheet 3
P3_BTP3: E50.12(D:I0) E56.13(A:I2) ; also sheet 3,4
P3_BTP4: E54.5(B:I1) E65.3(A:CLK) E118.7(CLK) E119.7(CLK) ; also sheet 2,3,4,5
P4_BTS1: E92.5(B:I2) E92.10(C:I1) E94.2(A:I1) ; also sheet 3,4
P4_CKSV: E59.3(A:CLK) ; also sheet 2,4,5
P4_CKUF: E59.11(B:CLK) ; also sheet 4
P4_CKUFB: E60.3(A:CLK) ; also sheet 4
P4_FATAL(0): E83.12(/1:A1) ; also sheet 4
P4_NEW_FLD: E56.2(A:I1) ; also sheet 2,4,5
P4_PCLR: E121.15(CLR) ; also sheet 2,4
P4_PLXA: E65.1(A:CLR) E121.7(CLK) E122.7(CLK) ; also sheet 2,4
P6_BIND2: E72.2(B:O) E92.4(B:I1) E92.11(C:I2) E94.1(A:I0) ; also sheet 3
P6_DIOI: E46.15(Q4) ; also sheet 3
P6_EBM: E46.10(Q3) ; also sheet 5
P6_EEM: E35.15(Q4) ; also sheet 3,4
P6_EN5: E35.10(Q3) ; also sheet 4
P6_EN9: E35.7(Q2) ; also sheet 4
P6_MAINT: E48.1(A:O) E56.1(A:I0) ; also sheet 4
P6_PRUP: E55.1(1G) E64.8(C:I0) E65.6(A:!Q)
P6_RVFEN: E35.2(Q1) ; also sheet 3
P6_USM: E8.3(A:I1) E8.6(B:I1) E59.8(B:!Q) ; also sheet 1,3,4,5
VCC: C1.+ C2.1 C3.1 C4.1 C5.1 C6.1 C7.1 C8.+ C9.1 C10.1 C11.1 C13.1 C14.+ C15.1 C16.+ C17.1 C18.1 C20.1 C21.1 C22.1 C23.1 C24.+ C25.1 C26.1 C27.1 C28.1 C29.1 C31.1 C32.1 C33.1 C34.1 C35.1 C36.1 R11.2 R13.2 R37.2 R38.2 R39.2 U$1.AA2 U$1.BA2 U$1.CA2 ; also sheet 1,2,3,4,5
Unconnected: E46.2(Q1) E46.3(!Q1) E46.4(D1) E46.7(Q2) E55.13(2Y2) E55.14(2A2) E59.5(A:Q) E60.5(A:Q) E64.10(C:O) E65.8(B:!Q)

### Notes on the sheet
- Remote Bank Sel. B
- Local Bank Sel. B
- Remote Bank Sel. A
- NC after rework
- Local Bank Sel. A
- UMB
- UMFF | SVUF
- KT8-A Memory Management Board
- D-CS-M8416-0-1 | D

## Sheet 7 of 7
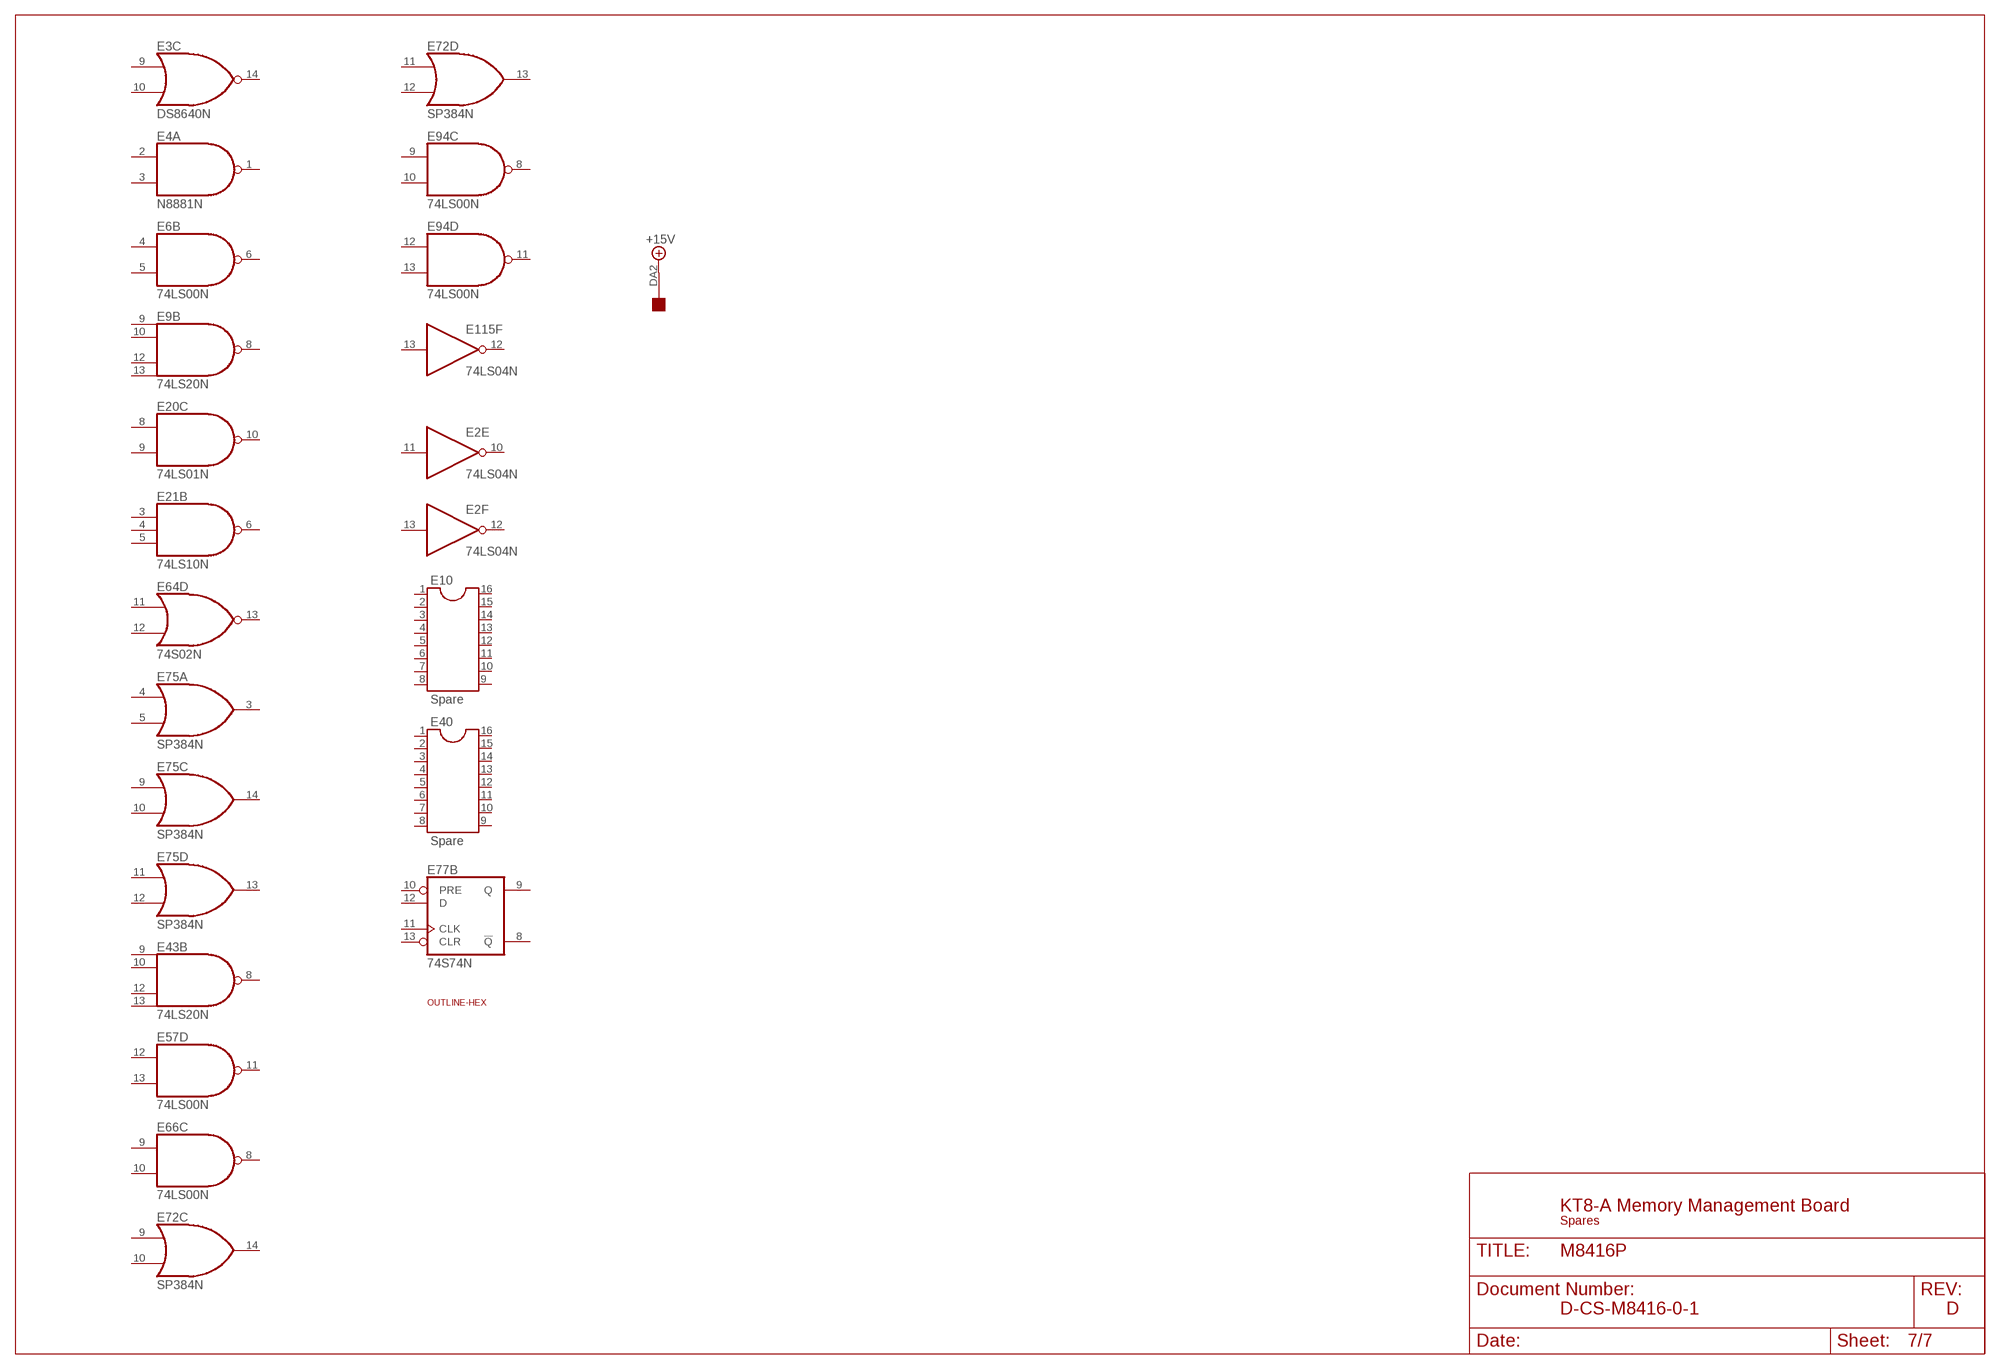
[diagram p9: schematic, sheet 7]

### Parts
E10  Spare  DIL16S  [SOCKET-16]
E40  Spare  DIL16S  [SOCKET-16]
U$2  OUTLINE-HEX  [HEX-HEIGHT]

### Nets
+15V: U$1.DA2
Unconnected: E2.10(E:O) E2.11(E:I) E2.12(F:O) E2.13(F:I) E3.9(C:I0) E3.10(C:I1) E3.14(C:O) E4.1(A:O) E4.2(A:I0) E4.3(A:I1) E6.4(B:I0) E6.5(B:I1) E6.6(B:O) E9.8(B:O) E9.9(B:I0) E9.10(B:I1) E9.12(B:I2) E9.13(B:I3) E10.1 E10.2 E10.3 E10.4 E10.5 E10.6 E10.7 E10.8 E10.9 E10.10 E10.11 E10.12 E10.13 E10.14 E10.15 E10.16 E20.8(C:I0) E20.9(C:I1) E20.10(C:O) E21.3(B:I0) E21.4(B:I1) E21.5(B:I2) E21.6(B:O) E40.1 E40.2 E40.3 E40.4 E40.5 E40.6 E40.7 E40.8 E40.9 E40.10 E40.11 E40.12 E40.13 E40.14 E40.15 E40.16 E43.8(B:O) E43.9(B:I0) E43.10(B:I1) E43.12(B:I2) E43.13(B:I3) E57.11(D:O) E57.12(D:I0) E57.13(D:I1) E64.11(D:I0) E64.12(D:I1) E64.13(D:O) E66.8(C:O) E66.9(C:I0) E66.10(C:I1) E72.9(C:I0) E72.10(C:I1) E72.11(D:I0) E72.12(D:I1) E72.13(D:O) E72.14(C:O) E75.3(A:O) E75.4(A:I0) E75.5(A:I1) E75.9(C:I0) E75.10(C:I1) E75.11(D:I0) E75.12(D:I1) E75.13(D:O) E75.14(C:O) E77.8(B:!Q) E77.9(B:Q) E77.10(B:PRE) E77.11(B:CLK) E77.12(B:D) E77.13(B:CLR) E94.8(C:O) E94.9(C:I0) E94.10(C:I1) E94.11(D:O) E94.12(D:I0) E94.13(D:I1) E115.12(F:O) E115.13(F:I)

### Notes on the sheet
- KT8-A Memory Management Board
- Spares
- D-CS-M8416-0-1 | D

## Power pins joined to a net without a drawn wire
GND: E1.8(GND) E2.7(P:GND) E3.1(P:GND) E4.7(P:GND) E5.7(P:GND) E6.7(P:GND) E7.7(P:GND) E8.7(P:GND) E9.7(P:GND) E11.1(P:GND) E12.8(GND) E13.8(GND) E14.14(GND) E15.8(GND) E16.14(GND) E17.8(GND) E18.7(P:GND) E19.7(P:GND) E20.7(P:GND) E21.7(P:GND) E22.7(P:GND) E23.8(GND) E24.7(P:GND) E25.1(P:GND) E27.7(P:GND) E28.8(GND) E29.7(P:GND) E30.7(GND) E31.12(GND) E32.7(P:GND) E33.7(P:GND) E34.8(GND) E35.8(GND) E36.7(P:GND) E37.8(GND) E38.7(P:GND) E39.7(P:GND) E41.1(P:GND) E42.7(P:GND) E43.7(P:GND) E44.7(P:GND) E45.8(GND) E46.8(GND) E47.7(P:GND) E48.7(P:GND) E49.7(P:GND) E50.7(P:GND) E51.1(P:GND) E52.1(GND) E53.1(GND) E54.7(P:GND) E55.8(GND) E56.7(P:GND) E57.7(P:GND) E58.7(P:GND) E59.7(P:GND) E60.7(P:GND) E61.1(P:GND) E62.8(GND) E63.7(P:GND) E64.7(P:GND) E65.7(P:GND) E66.7(P:GND) E67.7(P:GND) E68.8(GND) E69.8(GND) E70.7(P:GND) E71.1(P:GND) E72.1(GND) E73.8(GND) E74.8(GND) E75.1(GND) E76.7(P:GND) E77.7(P:GND) E78.8(GND) E79.8(GND) E80.8(GND) E81.14(GND) E82.8(GND) E84.8(GND) E85.8(GND) E86.8(GND) E87.8(GND) E88.8(GND) E89.8(GND) E90.8(GND) E91.8(GND) E92.7(P:GND) E93.8(GND) E94.7(P:GND) E95.8(GND) E96.8(GND) E97.8(GND) E98.8(GND) E99.8(GND) E100.8(GND) E102.8(GND) E103.8(GND) E104.8(GND) E105.8(GND) E106.8(GND) E107.8(GND) E108.8(GND) E109.14(GND) E110.8(GND) E111.8(GND) E112.8(GND) E113.8(GND) E114.8(GND) E115.7(P:GND) E116.8(GND) E117.8(GND) E118.8(GND) E119.8(GND) E120.8(P:GND) E121.8(GND) E122.8(GND)
VCC: E1.16(VCC) E2.14(P:VCC) E3.8(P:VCC) E4.14(P:VCC) E5.14(P:VCC) E6.14(P:VCC) E7.14(P:VCC) E8.14(P:VCC) E9.14(P:VCC) E11.8(P:VCC) E12.16(VCC) E13.16(VCC) E14.28(VCC) E15.16(VCC) E16.28(VCC) E17.16(VCC) E18.14(P:VCC) E19.14(P:VCC) E20.14(P:VCC) E21.14(P:VCC) E22.14(P:VCC) E23.16(VCC) E24.14(P:VCC) E25.8(P:VCC) E27.14(P:VCC) E28.16(VCC) E29.14(P:VCC) E30.14(VCC) E31.24(VCC) E32.14(P:VCC) E33.14(P:VCC) E34.16(VCC) E35.16(VCC) E36.14(P:VCC) E37.16(VCC) E38.14(P:VCC) E39.14(P:VCC) E41.8(P:VCC) E42.14(P:VCC) E43.14(P:VCC) E44.14(P:VCC) E45.16(VCC) E46.16(VCC) E47.14(P:VCC) E48.14(P:VCC) E49.14(P:VCC) E50.14(P:VCC) E51.8(P:VCC) E52.8(VCC) E53.8(VCC) E54.14(P:VCC) E55.16(VCC) E56.14(P:VCC) E57.14(P:VCC) E58.14(P:VCC) E59.14(P:VCC) E60.14(P:VCC) E61.8(P:VCC) E62.16(VCC) E63.14(P:VCC) E64.14(P:VCC) E65.14(P:VCC) E66.14(P:VCC) E67.14(P:VCC) E68.16(VCC) E69.16(VCC) E70.14(P:VCC) E71.8(P:VCC) E72.8(VCC) E73.16(VCC) E74.16(VCC) E75.8(VCC) E76.14(P:VCC) E77.14(P:VCC) E78.16(VCC) E79.16(VCC) E80.16(VCC) E81.28(VCC) E82.16(VCC) E84.16(VCC) E85.16(VCC) E86.16(VCC) E87.16(VCC) E88.16(VCC) E89.16(VCC) E90.16(VCC) E91.16(VCC) E92.14(P:VCC) E93.16(VCC) E94.14(P:VCC) E95.16(VCC) E96.16(VCC) E97.16(VCC) E98.16(VCC) E99.16(VCC) E100.16(VCC) E102.16(VCC) E103.16(VCC) E104.16(VCC) E105.16(VCC) E106.16(VCC) E107.16(VCC) E108.16(VCC) E109.28(VCC) E110.16(VCC) E111.16(VCC) E112.16(VCC) E113.16(VCC) E114.16(VCC) E115.14(P:VCC) E116.16(VCC) E117.16(VCC) E118.16(VCC) E119.16(VCC) E120.16(P:VCC) E121.16(VCC) E122.16(VCC)

## Library data of the parts
C1 C8 C14 C16 C24 = dec-con:CPOL-USE20-8AXIAL: A 0.8 inch electrolytic.
C2-C7 C9-C11 C13 C15 C17 C18 C20-C23 C25-C29 C31-C36 = rcl:C-US: CAPACITOR, American symbol
C12 = dec-con:C-US: Capacitors with funky DEC lead spacing.
D1 = diode:DIODE-: DIODE
E1 E62 E73 E90 E97-E99 E118 E119 E121 E122 = 74xx-us:74*173: 4-bit D type REGISTER, 3-state
E2 E5 E7 E22 E39 E44 E58 E115 = 74xx-us:74*04: Hex INVERTER
E3 E11 E25 E41 E51 E61 E71 = dec-con:DS8640: Quad NOR gate
E4 E8 E19 E42 = dec-con:N8881: Quad 2-input NAND gate, open collector
E6 E18 E50 E54 E57 E66 E70 E94 = 74xx-us:74*00: Quad 2-input NAND gate
E9 E36 E43 = 74xx-us:74*20: Dual 4-input NAND gate
E10 E40 = ic-package:DIL16: Dual In Line / Socket
E12 E13 E45 = dec-con:DS8641: Quad Bus Tranceiver
E14 E16 E81 E109 = dec-con:82S100: 16 Input, 8 Output PAL
E15 E17 E85 E88 E103 = 74xx-us:74*174: Hex D type FLIP FLOP, clear
E20 = 74xx-us:74*01: Quad 2-input NAND gate, open collector
E21 E24 E49 E56 E92 = 74xx-us:74*10: Triple 3-input NAND gate
E23 = 74xx-us:74*258: Quadruple 2-to 1 line data SELECTOR/MULTIPLEXER
E26 = 74ttl-din:74*75: 4-bit bistable LATCH
E27 = 74xx-us:74*11: Triple 3-input AND gate
E28 E74 E87 E113 = dec-con:74S287: 256x4 Bipolar ROM
E29 E47 E48 E64 = 74xx-us:74*02: Quad 2-input NOR gate
E30 = dec-con:74*30: 8-input NAND gate
E31 = 74xx-us:74*154: 4-line to 16-line data SELECTOR/MULTIPLEXER
E32 E59 E60 E63 E65 E76 E77 = 74xx-us:74*74: Dual D type positive edge triggered FLIP FLOP, preset and clear
E33 E67 = 74xx-us:74*08: Quad 2-input AND gate
E34 = 74xx-us:74*42: 4-line to 10-line DECODER (1-of-10)
E35 E46 E93 E102 E108 E110 E116 E117 = 74xx-us:74*175: Qadruple D type FLIP FLOP, clear
E37 E55 E84 E91 E104 E105 E107 = 74xx-us:74*367: Hex BUS DRIVER, 3-state
E38 = 74xx-us:74*37: Quad 2-input NAND buffer
E52 E53 E72 E75 = dec-con:SP384: Quad OR gate
E68 E78 = 74xx-us:74*85: 4-bit magnitude COMPARATOR
E69 E79 = dec-con:MC8266: Quad 2-1 selector
E80 = dec-con:74S288: 32x8 Bipolar ROM
E82 = dec-con:74*89: 16x4 Memory
E83 E101 = 74ttl-din:74*367: Hex BUS DRIVER, 3-state
E86 E95 E96 E100 E106 = 74xx-us:74*368: Hex BUS DRIVER, 3-state
E89 = 74xx-us:74*148: 10-line to 4-line and 8-line to 3-line PRIORITY ENCODER
E111 E112 E114 = dec-con:74S571: 512x4 Bipolar ROM
E120 = 74xx-us:74*139: Dual 2-line to 4-line DECODER/DEMULTIPLEXER
J1 = con-harting-h:10H: CONNECTOR; OC_FARNELL: unknown; OC_NEWARK: unknown
PAD1-PAD3 = wirepad:1,6/0,8: THROUGH-HOLE PAD
Q1 = transistor:*-NPN-: NPN Transistror BF959 corrected 2008.03.06
R1-R19 R21-R39 = rcl:R-US_: RESISTOR, American symbol
U$1 = dec-con:HEX: Hex-Height DEC Edge Connector
U$2 = dec-con:OUTLINE-*: Board outlines for DEC boards.